# Altium project USB3.2_Hub_4Port.PrjPcb (part 1 of 2)
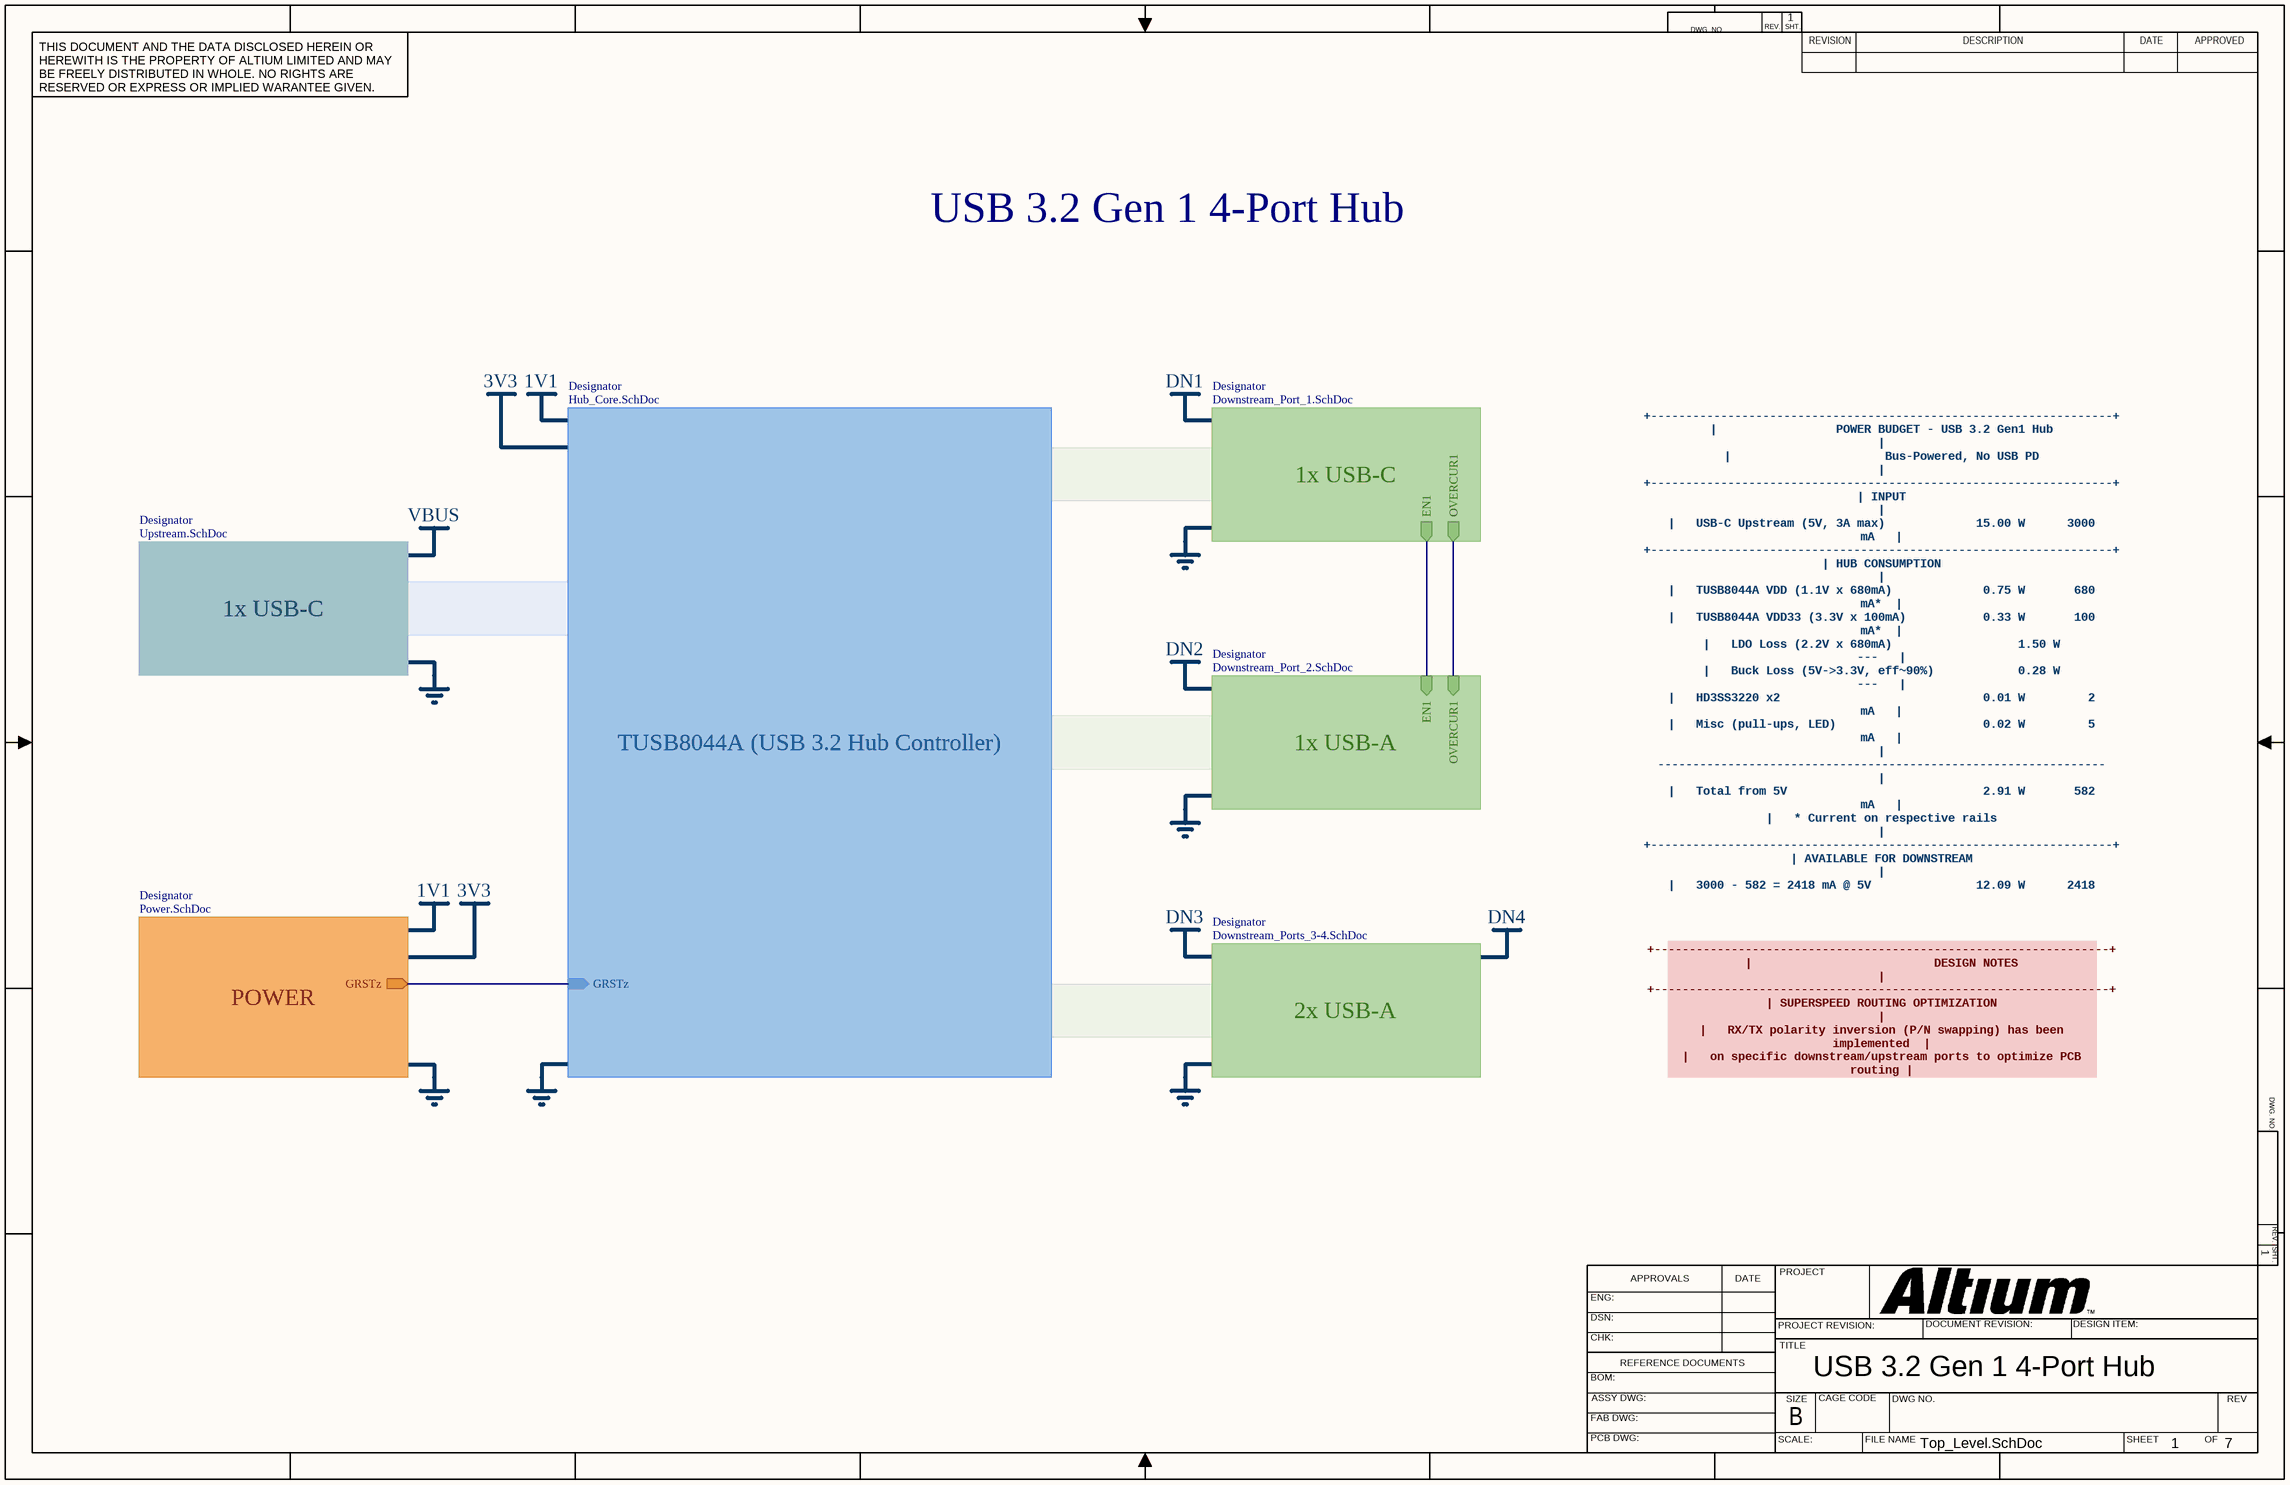
[diagram p0: Top_Level.SchDoc]
Author: Alberto Marrone; ProjectName: USB3.2_Hub_4Port; Revision: v1.0; Title: USB 3.2 Gen 1 4-Port Hub
7 sheets, 182 parts. Net scope: hierarchical (ports join the sheet entries above them; power ports are global).
Board file: USB3.2_Hub_4Port.PcbDoc
Sheets:
  Top_Level.SchDoc
    Designator = Upstream.SchDoc
    Designator = Power.SchDoc
    Designator = Hub_Core.SchDoc
    Designator = Downstream_Port_1.SchDoc
    Designator = Downstream_Ports_3-4.SchDoc
    Designator = Downstream_Port_2.SchDoc

## Sheet Top_Level.SchDoc: USB 3.2 Gen 1 4-Port Hub
size 431 x 279 mm; Author: Alberto Marrone; DrawnBy: Alberto Marrone; Engineer: Alberto Marrone; Revision: v1.0; SheetNumber: 1; SheetTotal: 7

### Sub-sheets
Designator = Upstream.SchDoc: no entries
Designator = Power.SchDoc: GRSTz (out)
Designator = Hub_Core.SchDoc: GRSTz (in)
Designator = Downstream_Port_1.SchDoc: EN1 (out), OVERCUR1 (out)
Designator = Downstream_Ports_3-4.SchDoc: no entries
Designator = Downstream_Port_2.SchDoc: OVERCUR1 (in), EN1 (in)

### Nets
EN1: sheet Designator/EN1, sheet Designator/EN1
GRSTz: sheet Designator/GRSTz, sheet Designator/GRSTz
OVERCUR1: sheet Designator/OVERCUR1, sheet Designator/OVERCUR1

### Notes on the sheet
- USB 3.2 Gen 1 4-Port Hub
- 3V3
- 1V1
- DN1
- 1x USB-C
- VBUS
- DN2
- TUSB8044A (USB 3.2 Hub Controller)
- 1x USB-A
- +------------------------------------------------------------------+
  |                 POWER BUDGET - USB 3.2 Gen1 Hub                  |
  |                      Bus-Powered, No USB PD                      |
  +------------------------------------------------------------------+
  | INPUT                                                            |
  |   USB-C Upstream (5V, 3A max)             15.00 W      3000 mA   |
  +------------------------------------------------------------------+
  | HUB CONSUMPTION                                                  |
  |   TUSB8044A VDD (1.1V x 680mA)             0.75 W       680 mA*  |
  |   TUSB8044A VDD33 (3.3V x 100mA)           0.33 W       100 mA*  |
  |   LDO Loss (2.2V x 680mA)                  1.50 W          ---   |
  |   Buck Loss (5V->3.3V, eff~90%)            0.28 W          ---   |
  |   HD3SS3220 x2                             0.01 W         2 mA   |
  |   Misc (pull-ups, LED)                     0.02 W         5 mA   |
  | ---------------------------------------------------------------- |
  |   Total from 5V                            2.91 W       582 mA   |
  |   * Current on respective rails                                  |
  +------------------------------------------------------------------+
  | AVAILABLE FOR DOWNSTREAM                                         |
  |   3000 - 582 = 2418 mA @ 5V               12.09 W      2418 mA   |
  +------------------------------------------------------------------+
  | PORT CURRENT LIMITS (Per Channel)                                |
  |   P1 USB-C (TPS2561#1)   R_ILIM=37.4k                1.5 A max   |
  |   P2 USB-A (TPS2561#1)   R_ILIM=37.4k                1.5 A max   |
  |   P3 USB-A (TPS2561#2)   R_ILIM=56.0k                1.0 A max   |
  |   P4 USB-A (TPS2561#2)   R_ILIM=56.0k                1.0 A max   |
  | ---------------------------------------------------------------- |
  |   Worst case all ports:                  5.0 A  [EXCEEDS BUDGET] |
  |   Typical 2 ports:                      ~1.0 A  [WITHIN BUDGET]  |
  +------------------------------------------------------------------+
  | NOTES                                                            |
  |   - Worst case exceeds 3A upstream. PC Host overcurrent          |
  |     protection will limit total draw.                            |
  |   - BC 1.2 CDP: 1.5A/port while data active.                     |
  |   - BC 1.2 DCP: 1.5A/port, upstream absent.                      |
  +------------------------------------------------------------------+
- DN3
- DN4
- POWER
- 2x USB-A
- +-----------------------------------------------------------------+
  |                          DESIGN NOTES                           |
  +-----------------------------------------------------------------+
  | SUPERSPEED ROUTING OPTIMIZATION                                 |
  |   RX/TX polarity inversion (P/N swapping) has been implemented  |
  |   on specific downstream/upstream ports to optimize PCB routing |
  |   and preserve Signal Integrity. This is fully compliant with   |
  |   the USB 3.2 Gen 1 specification, which mandates automatic     |
  |   polarity inversion detection at the receiver.                 |
  +-----------------------------------------------------------------+
- DWG. NO.
- REV.
- SHT.
- THIS DOCUMENT AND THE DATA DISCLOSED HEREIN OR HEREWITH IS THE PROPERTY OF ALTIUM LIMITED AND MAY BE FREELY DISTRIBUTED IN WHOLE. NO RIGHTS ARE RESERVED OR EXPRESS OR IMPLIED WARANTEE GIVEN.
- REVISION
- DESCRIPTION
- DATE
- APPROVED
- ENG:
- APPROVALS
- PROJECT
- DSN:
- CHK:
- REFERENCE DOCUMENTS
- PROJECT REVISION:
- TITLE
- DOCUMENT REVISION:
- DESIGN ITEM:
- BOM:
- FAB DWG:
- PCB DWG:
- ASSY DWG:
- SCALE:
- SIZE
- B
- CAGE CODE
- FILE NAME
- DWG NO.
- SHEET
- OF
- REV

## Sheet Upstream.SchDoc: USB 3.2 Gen 1 4-Port Hub
size 431 x 279 mm; Author: Alberto Marrone; DrawnBy: Alberto Marrone; Engineer: Alberto Marrone; Revision: v1.0; SheetNumber: 3; SheetTotal: 7
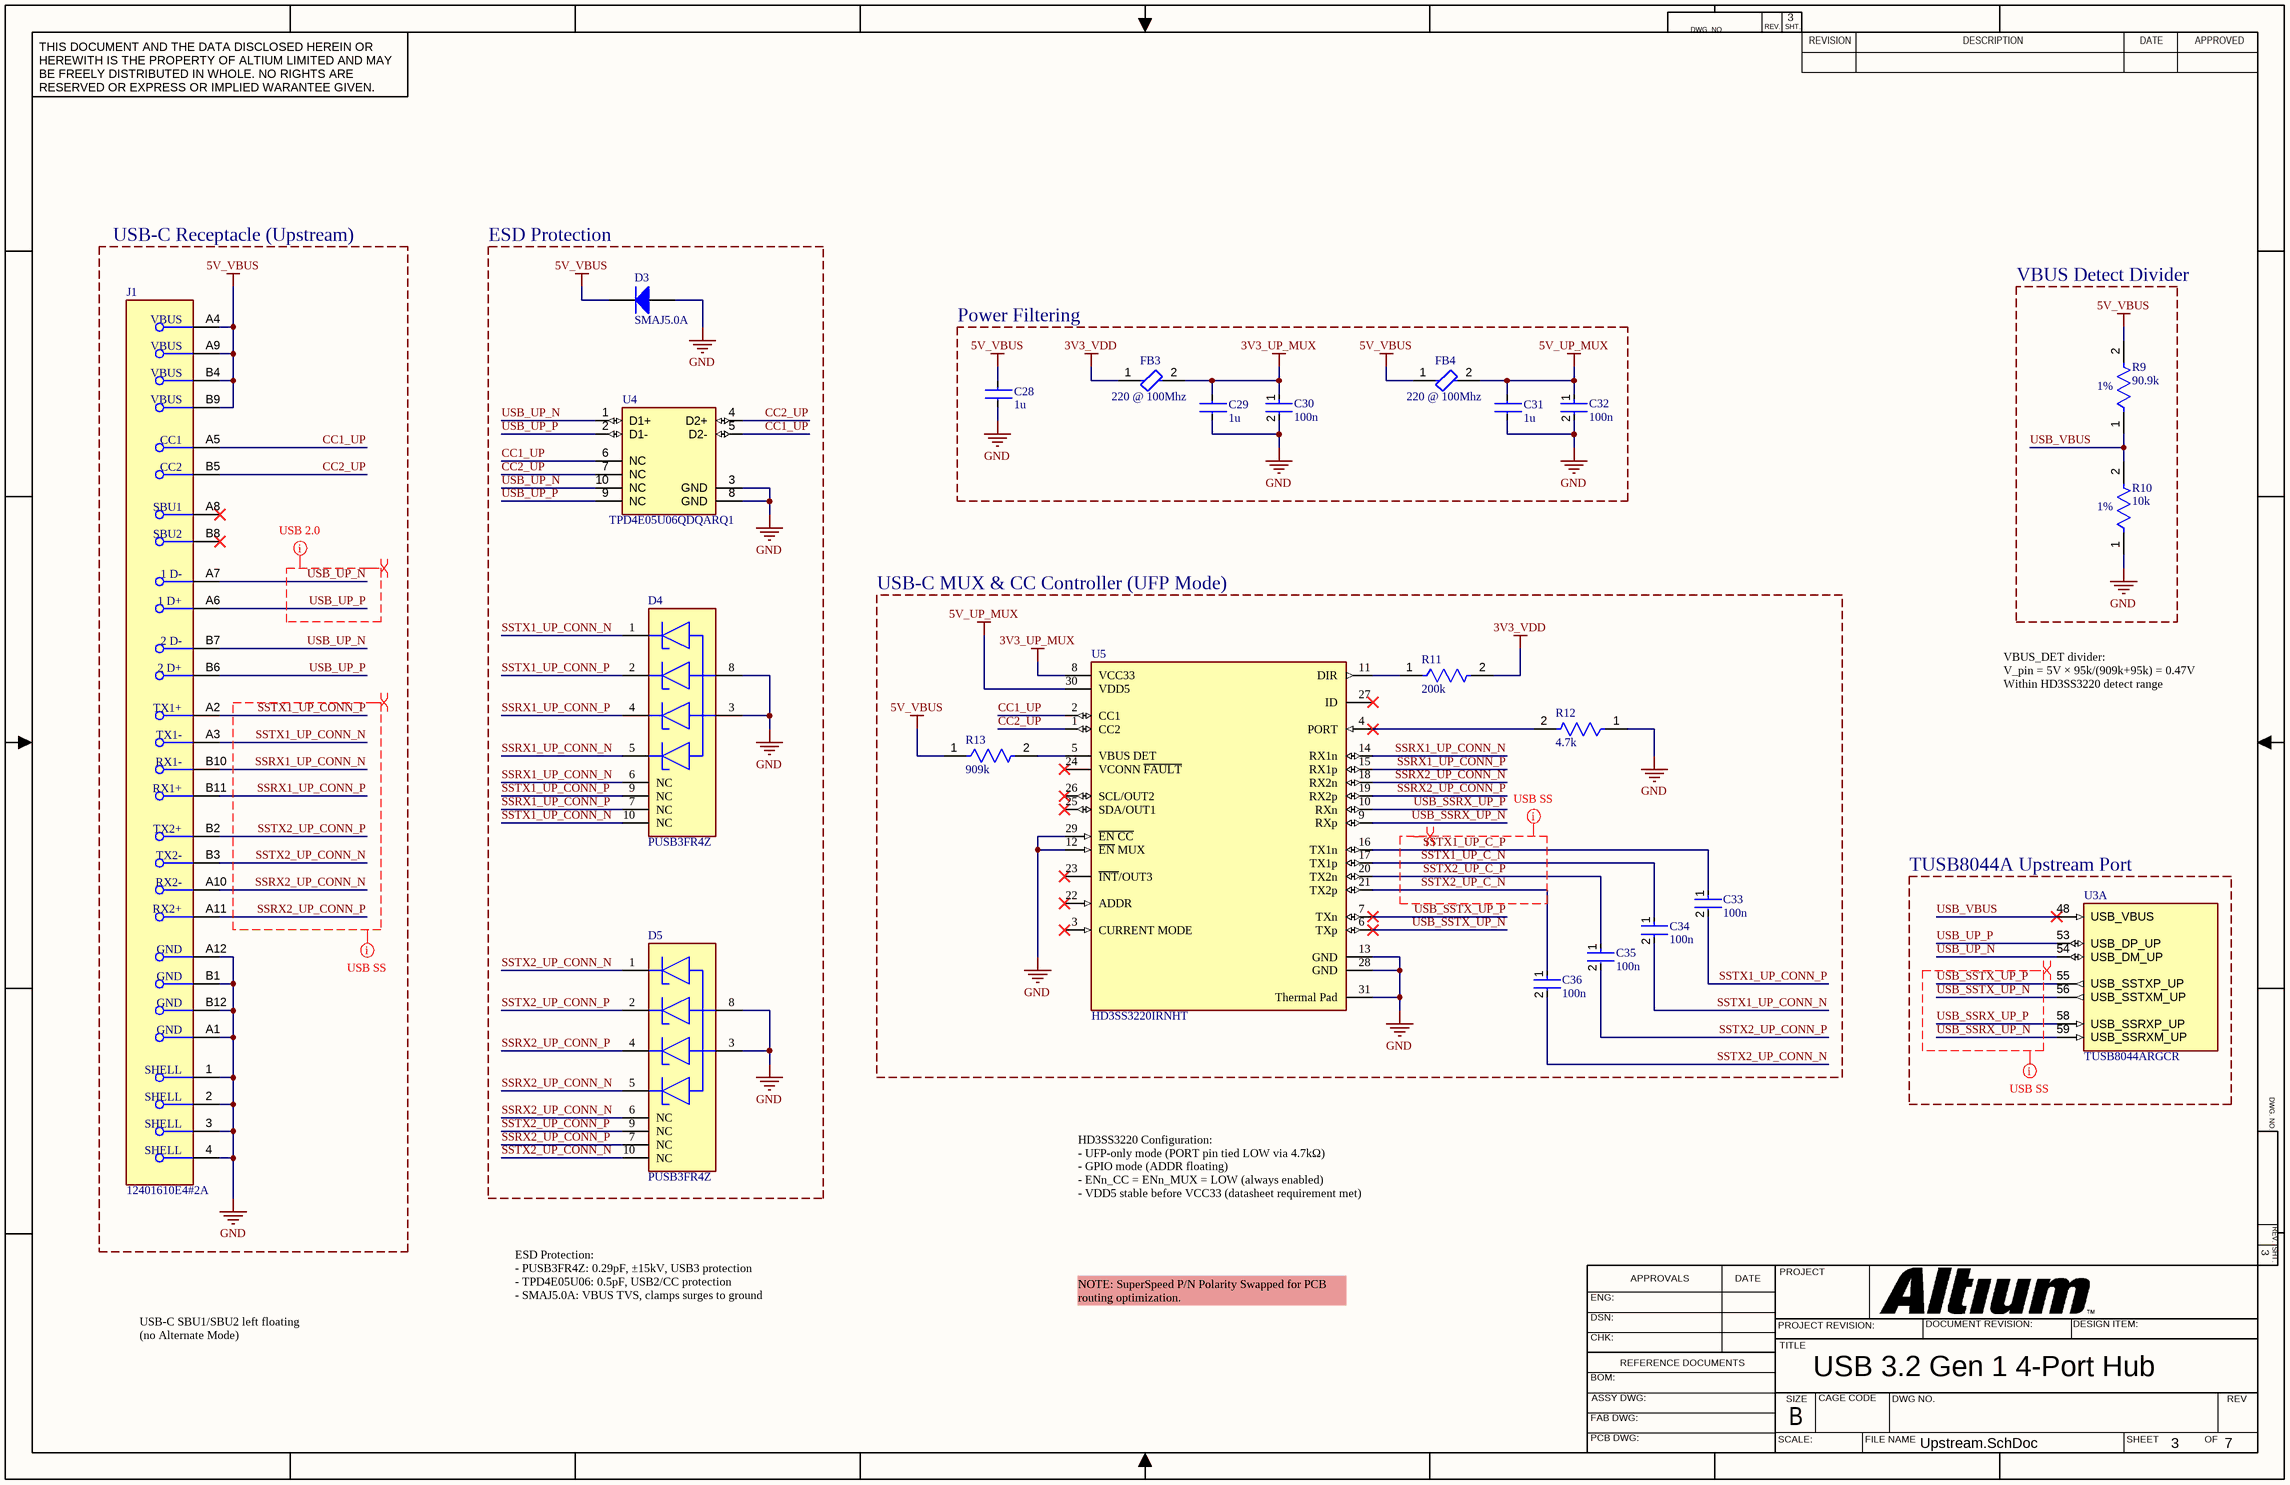
[diagram p1: Upstream.SchDoc]

### Parts
C28  1u  [CAPC1608X90N]
C29  1u  [CAPC1608X90N]
C30  100n  [FP-GRT155-0_05-IPC_C]
C31  1u  [CAPC1608X90N]
C32  100n  [FP-GRT155-0_05-IPC_C]
C33  100n  [FP-GRT155-0_05-IPC_C]
C34  100n  [FP-GRT155-0_05-IPC_C]
C35  100n  [FP-GRT155-0_05-IPC_C]
C36  100n  [FP-GRT155-0_05-IPC_C]
D3  SMAJ5.0A  [BOUR-SMA-2_V]
D4  PUSB3FR4Z  [FP-SOT1176-1-MFG]
D5  PUSB3FR4Z  [FP-SOT1176-1-MFG]
FB3  220 @ 100Mhz  [FP-BLM21-0_2-t0_85-e0_5-IPC_B]
FB4  220 @ 100Mhz  [FP-BLM21-0_2-t0_85-e0_5-IPC_B]
J1  12401610E4#2A  [FP-12401610E4#2A-MFG]
R9  90.9k  [FP-AC0402-MFG]
R10  10k  [FP-AC0402-MFG]
R11  200k  [FP-AC0402-MFG]
R12  4.7k  [FP-AC0402-MFG]
R13  909k  [FP-AC0402-IPC_A]
U3  TUSB8044ARGCR  [QFN50P900X900X100-65N-D]  (part A of 6)
U4  TPD4E05U06QDQARQ1  [FP-DQA0010A-MFG]
U5  HD3SS3220IRNHT  [FP-RNH0030A-MFG]

### Blocks framed on the sheet
USB-C Receptacle (Upstream): J1
ESD Protection: D3-D5 U4
Power Filtering: C28-C32 FB3 FB4
VBUS Detect Divider: R9 R10
USB-C MUX & CC Controller (UFP Mode): C33-C36 R11-R13 U5
TUSB8044A Upstream Port: U3

### Nets
3V3_UP_MUX: C29.2 C30.1 FB3.2 U5.8(VCC33)
3V3_VDD: FB3.1 R11.2
5V_UP_MUX: C31.2 C32.1 FB4.2 U5.30(VDD5)
5V_VBUS: C28.2 D3.2(K) FB4.1 J1.A4(VBUS) J1.A9(VBUS) J1.B4(VBUS) J1.B9(VBUS) R9.2 R13.1
GND: C28.1 C29.1 C30.2 C31.1 C32.2 D3.1(A) D4.3(GND) D4.8(GND) D5.3(GND) D5.8(GND) J1.1(SHELL) J1.2(SHELL) J1.3(SHELL) J1.4(SHELL) J1.A1(GND) J1.A12(GND) J1.B1(GND) J1.B12(GND) R10.1 R12.1 U4.3(GND) U4.8(GND) U5.12(~{EN}_MUX) U5.13(GND) U5.28(GND) U5.29(~{EN_CC}) U5.31(Thermal_Pad)
CC1_UP: J1.A5(CC1) U4.5(D2-) U4.6(NC) U5.2(CC1)
CC2_UP: J1.B5(CC2) U4.4(D2+) U4.7(NC) U5.1(CC2)
SSRX1_UP_CONN_N: D4.5(CH4) D4.6(NC) J1.B10(RX1-) U5.14(RX1n)
SSRX1_UP_CONN_P: D4.4(CH3) D4.7(NC) J1.B11(RX1+) U5.15(RX1p)
SSRX2_UP_CONN_N: D5.5(CH4) D5.6(NC) J1.A10(RX2-) U5.18(RX2n)
SSRX2_UP_CONN_P: D5.4(CH3) D5.7(NC) J1.A11(RX2+) U5.19(RX2p)
SSTX1_UP_C_N: C34.1 U5.17(TX1p)
SSTX1_UP_C_P: C33.1 U5.16(TX1n)
SSTX1_UP_CONN_N: C34.2 D4.1(CH1) D4.10(NC) J1.A3(TX1-)
SSTX1_UP_CONN_P: C33.2 D4.2(CH2) D4.9(NC) J1.A2(TX1+)
SSTX2_UP_C_N: C36.1 U5.21(TX2p)
SSTX2_UP_C_P: C35.1 U5.20(TX2n)
SSTX2_UP_CONN_N: C36.2 D5.1(CH1) D5.10(NC) J1.B3(TX2-)
SSTX2_UP_CONN_P: C35.2 D5.2(CH2) D5.9(NC) J1.B2(TX2+)
USB_SSRX_UP_N: U3.59(USB_SSRXM_UP) U5.9(RXp)
USB_SSRX_UP_P: U3.58(USB_SSRXP_UP) U5.10(RXn)
USB_SSTX_UP_N: U3.56(USB_SSTXM_UP) U5.6(TXp)
USB_SSTX_UP_P: U3.55(USB_SSTXP_UP) U5.7(TXn)
USB_UP_N: J1.A7(1_D-) J1.B7(2_D-) U3.54(USB_DM_UP) U4.1(D1+) U4.10(NC)
USB_UP_P: J1.A6(1_D+) J1.B6(2_D+) U3.53(USB_DP_UP) U4.2(D1-) U4.9(NC)
USB_VBUS: R9.1 R10.2 U3.48(USB_VBUS)
NetR11_1: R11.1 U5.11(DIR)
NetR12_2: R12.2 U5.4(PORT)
NetR13_2: R13.2 U5.5(VBUS_DET)

Not connected (* = marked no-connect by the designer): J1 A8(SBU1)* B8(SBU2)*; U5 3(CURRENT_MODE)* 22(ADDR)* 23(~{INT}/OUT3)* 24(VCONN_~{FAULT})* 25(SDA/OUT1)* 26(SCL/OUT2)* 27(ID)*

### Layout directives
differential pair: SSRX1_UP_CONN_N, SSRX1_UP_CONN_P, SSRX2_UP_CONN_N, SSRX2_UP_CONN_P, SSTX1_UP_C_N, SSTX1_UP_C_P, SSTX1_UP_CONN_N, SSTX1_UP_CONN_P, SSTX2_UP_C_N, SSTX2_UP_C_P, SSTX2_UP_CONN_N, SSTX2_UP_CONN_P, USB_SSRX_UP_N, USB_SSRX_UP_P, USB_SSTX_UP_N, USB_SSTX_UP_P, USB_UP_N, USB_UP_P
net class USB_SuperSpeed: SSRX1_UP_CONN_N, SSRX1_UP_CONN_P, SSRX2_UP_CONN_N, SSRX2_UP_CONN_P, SSTX1_UP_C_N, SSTX1_UP_C_P, SSTX1_UP_CONN_N, SSTX1_UP_CONN_P, SSTX2_UP_C_N, SSTX2_UP_C_P, SSTX2_UP_CONN_N, SSTX2_UP_CONN_P, USB_SSRX_UP_N, USB_SSRX_UP_P, USB_SSTX_UP_N, USB_SSTX_UP_P
net class USB_HighSpeed: USB_UP_N, USB_UP_P

### Notes on the sheet
- (near R9) 1%
- (near R10) 1%
- VBUS_DET divider:
  V_pin = 5V × 95k/(909k+95k) = 0.47V
  Within HD3SS3220 detect range
- HD3SS3220 Configuration:
  - UFP-only mode (PORT pin tied LOW via 4.7kΩ)
  - GPIO mode (ADDR floating)
  - ENn_CC = ENn_MUX = LOW (always enabled)
  - VDD5 stable before VCC33 (datasheet requirement met)
- NOTE: SuperSpeed P/N Polarity Swapped for PCB routing optimization.
- USB-C SBU1/SBU2 left floating
  (no Alternate Mode)
- ESD Protection:
  - PUSB3FR4Z: 0.29pF, ±15kV, USB3 protection
  - TPD4E05U06: 0.5pF, USB2/CC protection
  - SMAJ5.0A: VBUS TVS, clamps surges to ground
- DWG. NO.
- REV.
- SHT.
- THIS DOCUMENT AND THE DATA DISCLOSED HEREIN OR HEREWITH IS THE PROPERTY OF ALTIUM LIMITED AND MAY BE FREELY DISTRIBUTED IN WHOLE. NO RIGHTS ARE RESERVED OR EXPRESS OR IMPLIED WARANTEE GIVEN.
- REVISION
- DESCRIPTION
- DATE
- APPROVED
- ENG:
- APPROVALS
- PROJECT
- DSN:
- CHK:
- REFERENCE DOCUMENTS
- PROJECT REVISION:
- TITLE
- DOCUMENT REVISION:
- DESIGN ITEM:
- BOM:
- FAB DWG:
- PCB DWG:
- ASSY DWG:
- SCALE:
- SIZE
- B
- CAGE CODE
- FILE NAME
- DWG NO.
- SHEET
- OF
- REV

### Library data of the parts
C28 C29 C31 = C1608X7R1H105K080AB: The superior mechanical strength and reliability due to the monolithic structure.  Low ESR, ESL and excellent frequency characteristics allow for a circuit design that closely conforms to theoretical values.  Low self-heating and high ripple resistance due to low ESR.  No polarity; Manufacturer_Name: TDK; Geometry.Height: 0.9mm; Mouser Part Number: 810-C1608X7R1H105K08; Mouser Price/Stock: https://www.mouser.co.uk/ProductDetail/TDK/C1608X7R1H105K080AB?qs=efUn273yAhdzCWVW9RXgig%3D%3D; Manufacturer_Part_Number: C1608X7R1H105K080AB; Datasheet Link: https://media.digikey.com/pdf/Data%20Sheets/TDK%20PDFs/mlcc_commercial_general_Rev2018.pdf
C30 C32-C36 = CMP-06035-030480-1: Multi-Layer Ceramic Capacitor 100nF 50V X7R ±10% 0402 Paper T/R
D3 = CMP-2000-07090-1: SMAJ Transient Voltage Suppressor Diode Series, 3.5 V, -55 to 150 degC, 2-Pin SMA, RoHS, Tape and Reel; Manufacturer: Bourns; EDA / CAD Models: DownloadfromAcceleratedDesigns; Unidirectional Channels: 1; Voltage - Breakdown (Min): 6.4V; Voltage - Reverse Standoff (Typ): 5V; Voltage - Clamping (Max) @ Ipp: 9.2V; Other Names: SMAJ5.0ABDKR; Type: Zener; Catalog Drawings: SMAJSeriesFootprintSMAJ,SMBJSeries; Featured Product: SMAJ/SMBJ/SMCJ/SMLJDiscreteTVSDiodes; Power - Peak Pulse: 400W; Current - Peak Pulse (10/1000µs): 43.5A; Power Line Protection: No; Online Catalog: SMAJSeries; Supplier Device Package: SMA(DO-214AC); Operating Temperature: -55°C~150°C(TJ); Package Description: 2-Pin Surface Mount Device, Body 4.315 x 2.605 mm; Datasheet URL: https://datasheet.ciiva.com/25624/0900766b8112213b-25624680.pdf; Manufacturer URL: http://www.bourns.com/; Datasheet Version: 08/2012; Series: SMAJ; Family: TVS-Diodes; Bidirectional Channels: -; Applications: GeneralPurpose; Package Reference: SMA-2; Standard Package: 1; Package / Case: DO-214AC,SMA; Category: CircuitProtection; RoHS Information: SMAJSeriesMaterialDeclaration; Mounting Technology: SurfaceMount; Capacitance @ Frequency: -; Packaging: Digi-Reel®; Mounting Type: SurfaceMount
D4 D5 = CMP-14432-000005-1: TVS DIODE 3.3VWM 3VC DFN2510A-10; RoHS Compliant: Yes
FB3 FB4 = CMP-0686-00610-3: Chip Ferrite Bead, 0805, 220Ω @ 100MHz, 0.045Ω, 25%, 2A; Number of Circuits: 1; Shielding: Unshielded; DC Resistance (DCR): 45mR; Impedance: 220R; Radiation Hardening: No; Material: Ferrite; Frequency: 100MHz; Width: 1.25mm; DC Current: 2A; Max DC Current: 2A; Number of Lines: 1; Package Quantity: 1; Case Code (Metric): 2012; Current Rating: 2A; Case/Package: 0805; Current: 2A; Military Standard: Not; Core Material: Ferrite; Depth: 1.25mm; Contact Plating: Tin; DC Resistance-Max: 45mR; Max Operating Temperature: 125°C; Length: 2mm; Max Current Rating: 2A; REACH SVHC: No SVHC; Termination: SMD/SMT; Min Operating Temperature: -55°C; Series: BLM21P; Test Frequency: 100MHz; Tolerance: 25%; Number of Pins: 2; RoHS Compliant: Yes; Height: 0.85mm; Packaging: Tape and Reel; Lead Free: Lead Free; Case Code (Imperial): 0805
J1 = CMP-02355-000003-1: CONN RCP USB3.1 TYPEC 24P SMD RA; Connector Type: USB; Number of Contacts: 24; Gender: Receptacle; Packaging: Cut Tape; Mount: Surface Mount; Number of Pins: 24
R9 = CMP-03412-009342-2: RES 90.9kΩ ±1% 0.063W 0402; Voltage Rating: 50V; Resistance: 90.9kR; Temperature Coefficient: 100ppm/°C; Max Power Dissipation: 63mW; Power Rating: 62.5mW; Resistor Type: Thick Film; Length: 0.039inch; RoHS Compliant: Yes; Features: Moisture Resistant; Height: 0.015inch; Case Code (Imperial): 0402; Tolerance: 1%; Min Operating Temperature: -55°C; Case/Package: 0402; Width: 0.5mm; Series: AC; Termination: SMD/SMT; Number of Terminations: 2; Max Operating Temperature: 155°C; Case Code (Metric): 1005; Packaging: Tape and Reel
R10 = CMP-2002-01790-3: RES 10kΩ ±1% 0.063W 0402; Power Rating: 62.5mW; Voltage Rating: 50V; Temperature Coefficient: 100ppm/°C; Resistance: 10kR; Max Power Dissipation: 63mW; Tolerance: 1%; Military Standard: Not; Construction: Rectangular; Termination: SMD/SMT; Max Operating Temperature: 155°C; Min Operating Temperature: -55°C; Height: 0.015inch; Lead Free: Lead Free; Width: 0.02inch; Case/Package: 0402; Resistor Type: Thick Film; Series: AC; Features: Moisture Resistant; RoHS Compliant: Yes; Number of Terminations: 2; Case Code (Metric): 1005; Length: 0.039inch; Depth: 0.5mm; Size Code: 0402; Packaging: Tape and Reel; Case Code (Imperial): 0402
R11 = CMP-03412-002362-2: RES 200kΩ ±1% 0.063W 0402; Temperature Coefficient: 100ppm/°C; Voltage Rating: 50V; Max Power Dissipation: 63mW; Power Rating: 62.5mW; Resistance: 200kR; RoHS Compliant: Yes; Series: AC; Height: 0.015inch; Termination: SMD/SMT; Case Code (Imperial): 0402; Min Operating Temperature: -55°C; Weight: 2.3E-05oz; Case Code (Metric): 1005; Case/Package: 0402; Max Operating Temperature: 155°C; Width: 0.5mm; Size Code: 0402; Features: Moisture Resistant; Number of Terminations: 2; Tolerance: 1%; Packaging: Tape and Reel; Lead Free: Lead Free; Resistor Type: Thick Film; Length: 0.039inch
R12 = CMP-03412-009386-2: RES 4.7kΩ ±1% 0.063W 0402
R13 = CMP-03412-019105-2: RES 909kΩ ±1% 0.063W 0402; Power Rating: 62.5mW; Voltage Rating: 50V; Resistance: 909kR; Temperature Coefficient: 100ppm/°C; Max Power Dissipation: 63mW; Number of Terminations: 2; Packaging: Tape and Reel; Height: 0.015inch; Max Operating Temperature: 155°C; Series: AC; Resistor Type: Thick Film; Features: Moisture Resistant; Width: 0.5mm; RoHS Compliant: Yes; Length: 0.039inch; Case/Package: 0402; Min Operating Temperature: -55°C; Tolerance: 1%; Termination: SMD/SMT; Case Code (Imperial): 0402; Case Code (Metric): 1005
U3 = TUSB8044ARGCR: Four-port USB 3.2 x1 Gen1 hub with USB billboard; Manufacturer_Name: Texas Instruments; Geometry.Height: 1mm; Mouser Part Number: 595-TUSB8044ARGCR; Mouser Price/Stock: https://www.mouser.co.uk/ProductDetail/Texas-Instruments/TUSB8044ARGCR?qs=9r4v7xj2LnlTBCFutY1Bfg%3D%3D; Manufacturer_Part_Number: TUSB8044ARGCR; Datasheet Link: http://www.ti.com/lit/gpn/TUSB8044A
U4 = CMP-04985-000004-1: TVS DIODE 5.5V 14V 10USON; Manufacturer: Texas Instruments; Direction: Unidirectional; Standoff Height: 0mm; Capacitance: 0.5pF; Number Of Channels: 4; Breakdown Voltage: 6.4V; Peak Pulse Power: 2.5W; Automotive Grade: Grade 1; Value: 0.5pF; Interface: USB,Ethernet,LVDS,Other; Peak Pulse Current: 2.5A; Operating Supply Voltage: 5.5V; Reverse Standoff Voltage: 5.5V; Package: DQA0010A; Temperature Range Low: -40°C; Temperature Range High: +125°C; Ambient Temperature Range Low: -40°C; Device Class L1: Circuit Protection; Clamping Voltage: 14V; Manufacturer Part Number: TPD4E05U06QDQARQ1; Device Class L2: ESD and Circuit Protection ICs; Octopart: https://octopart.com/tpd4e05u06qdqarq1-texas+instruments-48523459; Device Class L3: unset; Height: 0.55mm; Automotive: Yes; ComponentLink2Description: Datasheet; RoHS: TRUE; Ambient Temperature Range High: +125°C; Category: IC; Mouser Description: Automotive 4-Channel ESD Protection Solution for SuperSpeed (up to 5 Gbps) Interface 10-USON -40 to 125; Temperature: -40°C to +125°C; ComponentLink2URL: http://www.ti.com/lit/ds/symlink/tpd4e05u06-q1.pdf; Digikey Description: TVS DIODE 5.5V 14V 10USON; Lead Free: Yes
U5 = CMP-04877-000019-1: USB TYPE-C DRP PORT CONTROLLER W; Max Supply Voltage: 5.5V; Min Supply Voltage: 3V; Number of Ports: 1; Data Rate: 10Gbps; USB Standard: USB 3.1; Mount: Surface Mount; Max Operating Temperature: 70°C; Lead Free: Lead Free; RoHS Compliant: Yes; Packaging: Tape and Reel; Number of Pins: 30; Min Operating Temperature: 0°C; REACH SVHC: No SVHC

## Sheet Power.SchDoc: USB 3.2 Gen 1 4-Port Hub
size 431 x 279 mm; Author: Alberto Marrone; DrawnBy: Alberto Marrone; Engineer: Alberto Marrone; Revision: v1.0; SheetNumber: 2; SheetTotal: 7
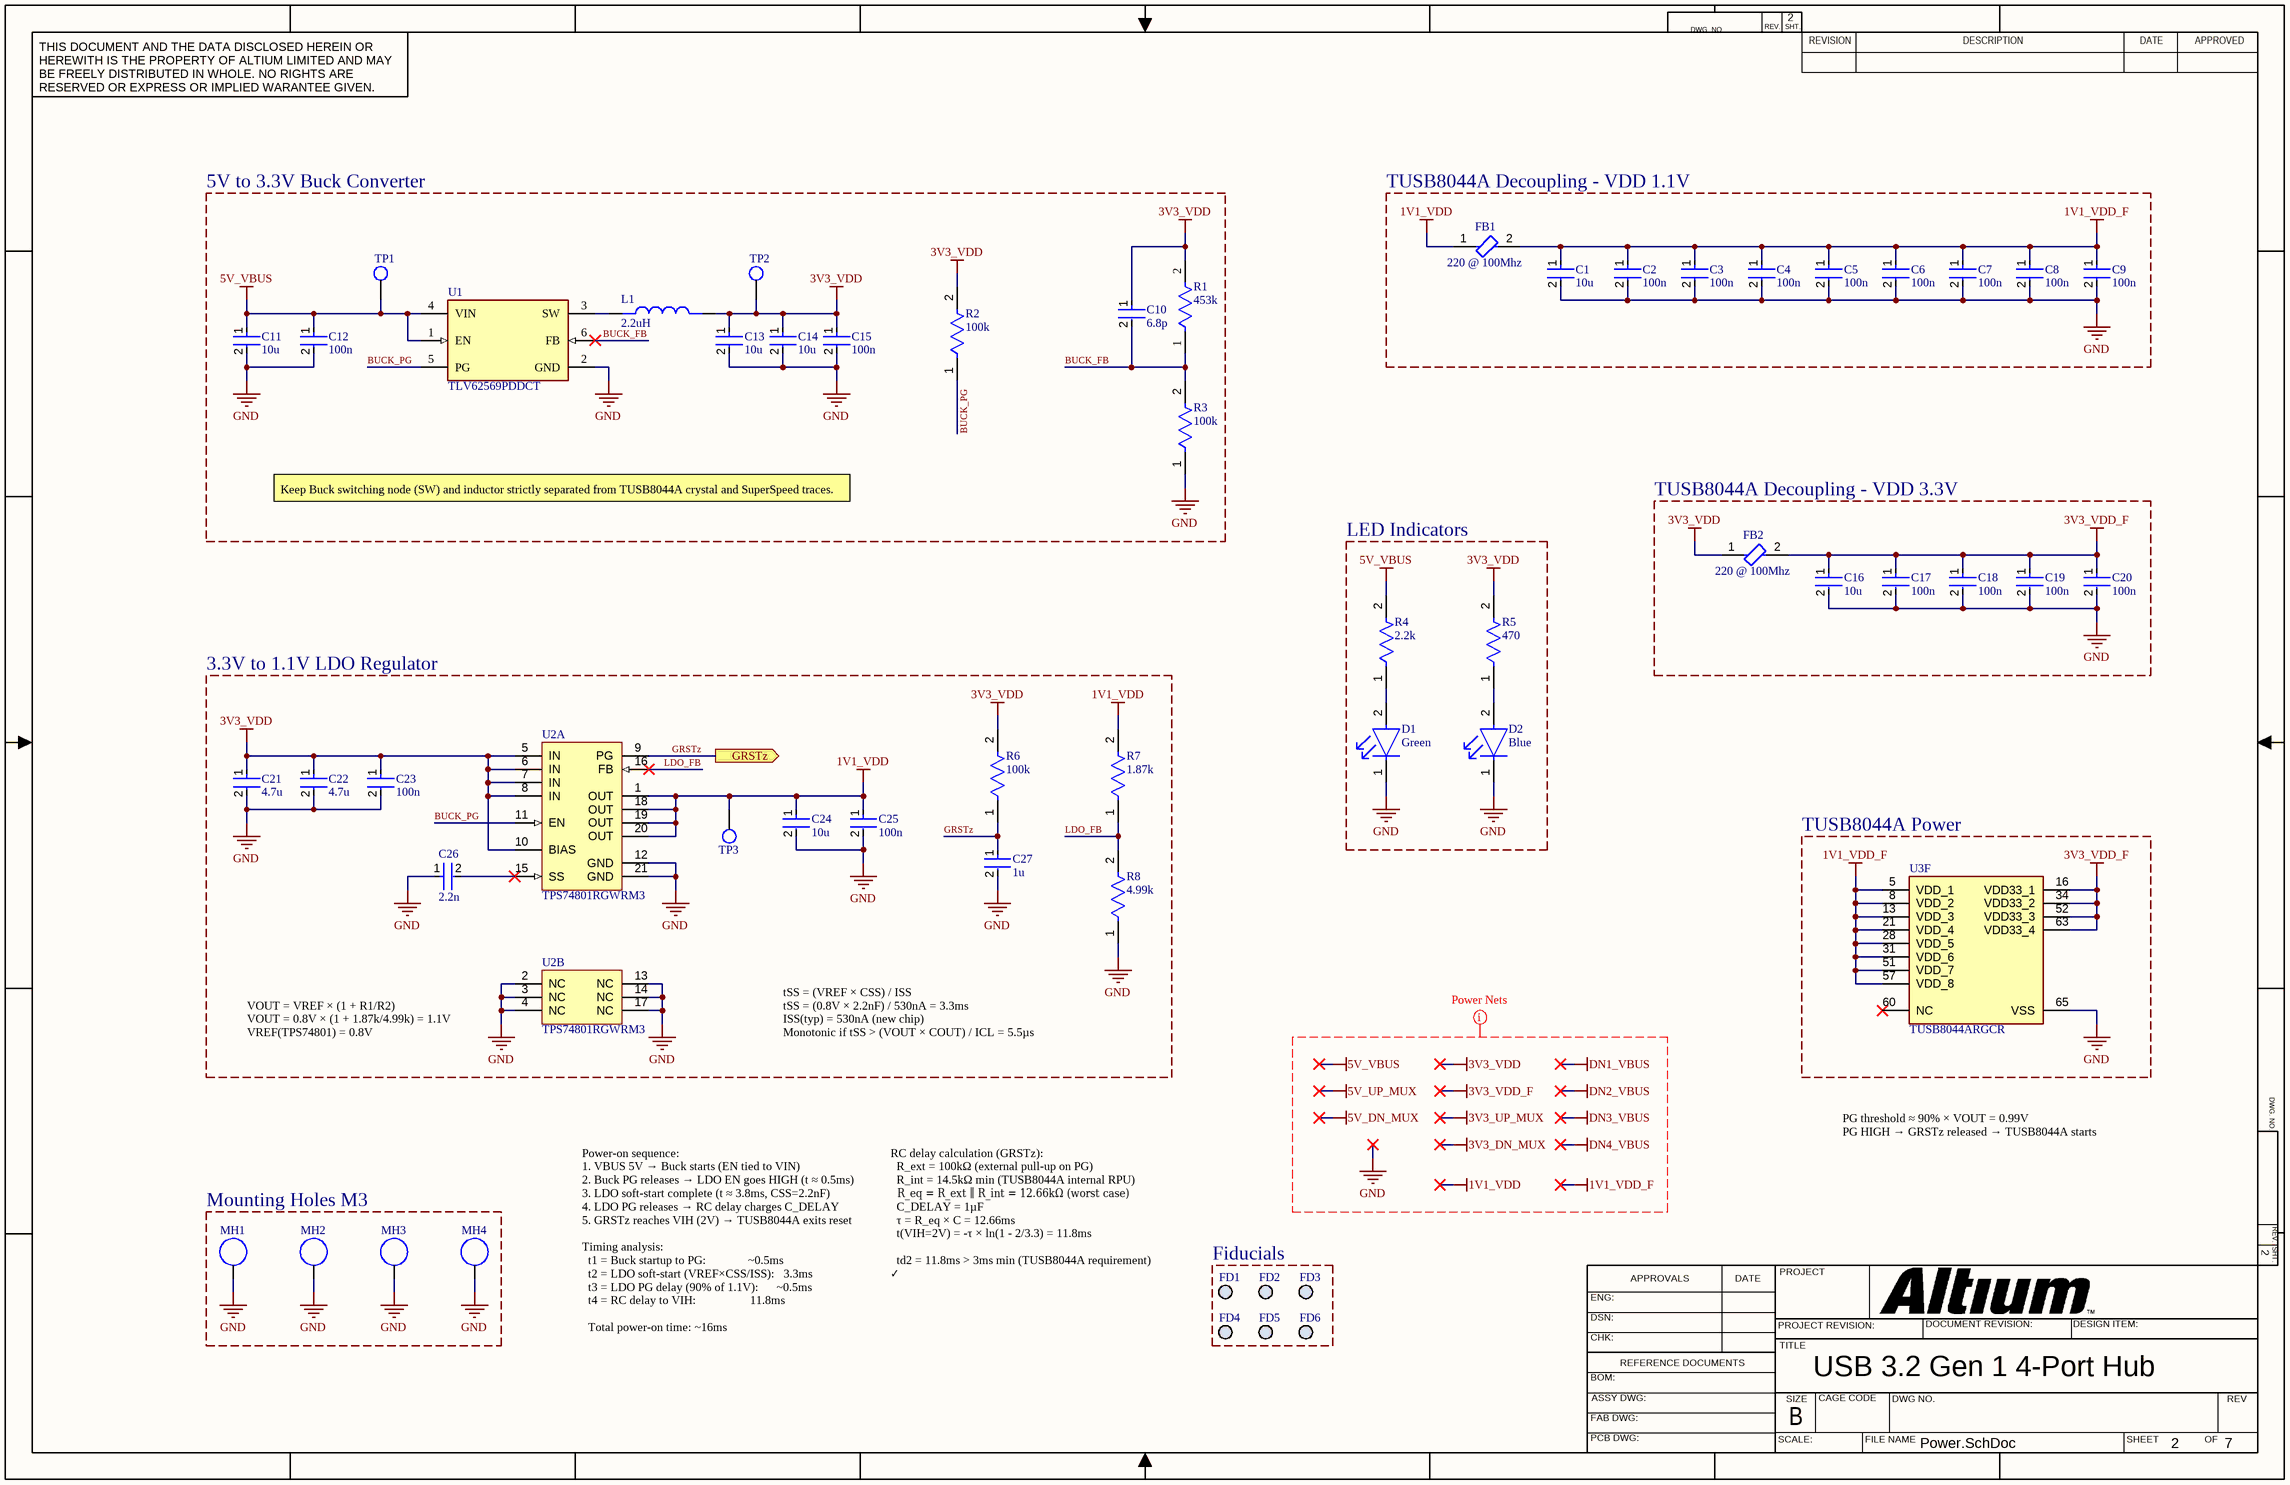
[diagram p2: Power.SchDoc]

### Parts
C1  10u  [FP-GRM21B-0_2-e0_2_0_7-IPC_B]
C2  100n  [FP-GRT155-0_05-IPC_C]
C3  100n  [FP-GRT155-0_05-IPC_C]
C4  100n  [FP-GRT155-0_05-IPC_C]
C5  100n  [FP-GRT155-0_05-IPC_C]
C6  100n  [FP-GRT155-0_05-IPC_C]
C7  100n  [FP-GRT155-0_05-IPC_C]
C8  100n  [FP-GRT155-0_05-IPC_C]
C9  100n  [FP-GRT155-0_05-IPC_C]
C10  6.8p  [FP-GCM155-0_05-IPC_B]
C11  10u  [FP-GRM21B-0_2-e0_2_0_7-IPC_B]
C12  100n  [FP-GRT155-0_05-IPC_C]
C13  10u  [FP-GRM21B-0_2-e0_2_0_7-IPC_B]
C14  10u  [FP-GRM21B-0_2-e0_2_0_7-IPC_B]
C15  100n  [FP-GRT155-0_05-IPC_C]
C16  10u  [FP-GRM21B-0_2-e0_2_0_7-IPC_B]
C17  100n  [FP-GRT155-0_05-IPC_C]
C18  100n  [FP-GRT155-0_05-IPC_C]
C19  100n  [FP-GRT155-0_05-IPC_C]
C20  100n  [FP-GRT155-0_05-IPC_C]
C21  4.7u  [FP-GRM21B-0_2-e0_2_0_7-IPC_A]
C22  4.7u  [FP-GRM21B-0_2-e0_2_0_7-IPC_A]
C23  100n  [FP-GRT155-0_05-IPC_C]
C24  10u  [FP-GRM21B-0_2-e0_2_0_7-IPC_B]
C25  100n  [FP-GRT155-0_05-IPC_C]
C26  2.2n  [FP-AC0402-0_5-MFG]
C27  1u  [FP-GRM155-0_1-IPC_C]
D1  Green  [FP-LTST-C190KGKT-MFG]
D2  Blue  [FP-LTST-C193TBKT-5A-MFG]
FB1  220 @ 100Mhz  [FP-BLM21-0_2-t0_85-e0_5-IPC_B]
FB2  220 @ 100Mhz  [FP-BLM21-0_2-t0_85-e0_5-IPC_B]
FD1  Fiducial_Marker  [Fiducial_Standard]  (value not drawn)  (no BOM)
FD2  Fiducial_Marker  [Fiducial_Standard]  (value not drawn)  (no BOM)
FD3  Fiducial_Marker  [Fiducial_Standard]  (value not drawn)  (no BOM)
FD4  Fiducial_Marker  [Fiducial_Standard]  (value not drawn)  (no BOM)
FD5  Fiducial_Marker  [Fiducial_Standard]  (value not drawn)  (no BOM)
FD6  Fiducial_Marker  [Fiducial_Standard]  (value not drawn)  (no BOM)
L1  2.2uH  [IND_ETQP3M3R3YFP]
MH1  Mounting_Hole_M3  [MH_M3_Stitched]  (value not drawn)  (no BOM)
MH2  Mounting_Hole_M3  [MH_M3_Stitched]  (value not drawn)  (no BOM)
MH3  Mounting_Hole_M3  [MH_M3_Stitched]  (value not drawn)  (no BOM)
MH4  Mounting_Hole_M3  [MH_M3_Stitched]  (value not drawn)  (no BOM)
R1  453k  [FP-ERJ2RK-MFG]
R2  100k  [FP-AC0402-MFG]
R3  100k  [FP-AC0402-MFG]
R4  2.2k  [FP-AC0402-MFG]
R5  470  [FP-AC0402-MFG]
R6  100k  [FP-AC0402-MFG]
R7  1.87k  [FP-AC0402-IPC_A]
R8  4.99k  [FP-AC0402-IPC_A]
TP1  Test_Point  [Test_Point]  (value not drawn)  (no BOM)
TP2  Test_Point  [Test_Point]  (value not drawn)  (no BOM)
TP3  Test_Point  [Test_Point]  (value not drawn)  (no BOM)
U1  TLV62569PDDCT  [FP-DDC0006A-IPC_C]
U2  TPS74801RGWRM3  [TI-RGW20-3150X3150TP_V]  (parts A,B of 2)
U3  TUSB8044ARGCR  [QFN50P900X900X100-65N-D]  (part F of 6)

### Blocks framed on the sheet
5V to 3.3V Buck Converter: C10-C15 L1 R1-R3 TP1 TP2 U1
TUSB8044A Decoupling - VDD 1.1V: C1-C9 FB1
LED Indicators: D1 D2 R4 R5
TUSB8044A Decoupling - VDD 3.3V: C16-C20 FB2
3.3V to 1.1V LDO Regulator: C21-C27 R6-R8 TP3 U2
TUSB8044A Power: U3
Mounting Holes M3: MH1-MH4
Fiducials: FD1-FD6

### Ports
GRSTz (out, see Top_Level[7C], Hub_Core[5D])

### Nets
1V1_VDD: C24.1 C25.1 FB1.1 R7.2 TP3.1 U2.1(OUT) U2.18(OUT) U2.19(OUT) U2.20(OUT)
1V1_VDD_F: C1.1 C2.1 C3.1 C4.1 C5.1 C6.1 C7.1 C8.1 C9.1 FB1.2 U3.5(VDD_1) U3.8(VDD_2) U3.13(VDD_3) U3.21(VDD_4) U3.28(VDD_5) U3.31(VDD_6) U3.51(VDD_7) U3.57(VDD_8)
3V3_VDD: C10.1 C13.1 C14.1 C15.1 C21.1 C22.1 C23.1 FB2.1 L1.2 R1.2 R2.2 R5.2 R6.2 TP2.1 U2.5(IN) U2.6(IN) U2.7(IN) U2.8(IN) U2.10(BIAS)
3V3_VDD_F: C16.1 C17.1 C18.1 C19.1 C20.1 FB2.2 U3.16(VDD33_1) U3.34(VDD33_2) U3.52(VDD33_3) U3.63(VDD33_4)
5V_VBUS: C11.1 C12.1 R4.2 TP1.1 U1.1(EN) U1.4(VIN)
GND: C1.2 C2.2 C3.2 C4.2 C5.2 C6.2 C7.2 C8.2 C9.2 C11.2 C12.2 C13.2 C14.2 C15.2 C16.2 C17.2 C18.2 C19.2 C20.2 C21.2 C22.2 C23.2 C24.2 C25.2 C26.1 C27.2 D1.1(C) D2.1(C) MH1.1 MH2.1 MH3.1 MH4.1 R3.1 R8.1 U1.2(GND) U2.2(NC) U2.3(NC) U2.4(NC) U2.12(GND) U2.13(NC) U2.14(NC) U2.17(NC) U2.21(GND) U3.65(VSS)
BUCK_FB: C10.2 R1.1 R3.2 U1.6(FB)
BUCK_PG: R2.1 U1.5(PG) U2.11(EN)
GRSTz: C27.1 R6.1 U2.9(PG) ; port GRSTz
LDO_FB: R7.1 R8.2 U2.16(FB)
NetC26_2: C26.2 U2.15(SS)
NetD1_2: D1.2(A) R4.1
NetD2_2: D2.2(A) R5.1
NetL1_1: L1.1 U1.3(SW)

Not connected (* = marked no-connect by the designer): U3 60(NC)*

### Layout directives
net class Power_Nets: 1V1_VDD, 1V1_VDD_F, 3V3_DN_MUX, 3V3_UP_MUX, 3V3_VDD, 3V3_VDD_F, 5V_DN_MUX, 5V_UP_MUX, 5V_VBUS, DN1_VBUS, DN2_VBUS, DN3_VBUS, DN4_VBUS, GND

### Notes on the sheet
- Keep Buck switching node (SW) and inductor strictly separated from TUSB8044A crystal and SuperSpeed traces.
- VOUT = VREF × (1 + R1/R2)
  VOUT = 0.8V × (1 + 1.87k/4.99k) = 1.1V
  VREF(TPS74801) = 0.8V
- tSS = (VREF × CSS) / ISS
  tSS = (0.8V × 2.2nF) / 530nA = 3.3ms
  ISS(typ) = 530nA (new chip)
  Monotonic if tSS > (VOUT × COUT) / ICL = 5.5µs
- PG threshold ≈ 90% × VOUT = 0.99V
  PG HIGH → GRSTz released → TUSB8044A starts
- RC delay calculation (GRSTz):
  R_ext = 100kΩ (external pull-up on PG)
  R_int = 14.5kΩ min (TUSB8044A internal RPU)
  R_eq = R_ext ∥ R_int = 12.66kΩ (worst case)
  C_DELAY = 1µF
  τ = R_eq × C = 12.66ms
  t(VIH=2V) = -τ × ln(1 - 2/3.3) = 11.8ms
  td2 = 11.8ms > 3ms min (TUSB8044A requirement) ✓
- Power-on sequence:
  1. VBUS 5V → Buck starts (EN tied to VIN)
  2. Buck PG releases → LDO EN goes HIGH (t ≈ 0.5ms)
  3. LDO soft-start complete (t ≈ 3.8ms, CSS=2.2nF)
  4. LDO PG releases → RC delay charges C_DELAY
  5. GRSTz reaches VIH (2V) → TUSB8044A exits reset
  Timing analysis:
  t1 = Buck startup to PG:              ~0.5ms
  t2 = LDO soft-start (VREF×CSS/ISS):   3.3ms
  t3 = LDO PG delay (90% of 1.1V):      ~0.5ms
  t4 = RC delay to VIH:                  11.8ms
  Total power-on time: ~16ms
- DWG. NO.
- REV.
- SHT.
- THIS DOCUMENT AND THE DATA DISCLOSED HEREIN OR HEREWITH IS THE PROPERTY OF ALTIUM LIMITED AND MAY BE FREELY DISTRIBUTED IN WHOLE. NO RIGHTS ARE RESERVED OR EXPRESS OR IMPLIED WARANTEE GIVEN.
- REVISION
- DESCRIPTION
- DATE
- APPROVED
- ENG:
- APPROVALS
- PROJECT
- DSN:
- CHK:
- REFERENCE DOCUMENTS
- PROJECT REVISION:
- TITLE
- DOCUMENT REVISION:
- DESIGN ITEM:
- BOM:
- FAB DWG:
- PCB DWG:
- ASSY DWG:
- SCALE:
- SIZE
- B
- CAGE CODE
- FILE NAME
- DWG NO.
- SHEET
- OF
- REV

### Library data of the parts
C1 C11 C13 C14 C16 C24 = CMP-06035-047417-1: Chip Multilayer Ceramic Capacitors for General Purpose, 0805, 10uF, X7R, 15%, 10%, 25V
C2-C9 C12 C15 C17-C20 C23 C25 = CMP-06035-030480-1: as C30 on sheet Upstream
C10 = CMP-06035-021449-1: Ceramic Capacitor for Automotive 6.8pF ±0.1pF 50VDC C0G 0402 Paper T/R
C21 C22 = CMP-06035-048385-1: Chip Multilayer Ceramic Capacitors for General Purpose, 0805, 4.7uF, X7R, 15%, 10%, 35V
C26 = CMP-03422-000843-1: CAP CER 2200PF 50V X7R 0402; Manufacturer: Yageo; Manufacturer Part Number: AC0402KRX7R9BB222; Value: 2.2 nF; Material: Ceramic; Temperature Coefficient: ±15%; Automotive Grade: Grade 1; Tolerance: 0.1; Temperature: -55°C to +125°C; Automotive: Yes; Device Class L1: Passive Components; Device Class L2: Capacitors; Package: AC0402-0.5; RoHS: TRUE; Temperature Range Low: -55°C; ComponentLink2Description: Datasheet; Category: Cap; Mouser Description: Cap Ceramic 0.0022uF 50V X7R 10% Pad SMD 0402 125C Automotive T/R; Lead Free: Yes; Digikey Description: CAP CER 2200PF 50V X7R 0402; Capacitance: 2.2 nF; Temperature Range High: +125°C; Footprint Url: http://www.yageo.com/exep/pages/download/literatures/UPY-C_GEN_24.pdf; Height: 0.55mm; Temperature Characteristic: X7R; ComponentLink2URL: http://www.yageo.com/documents/recent/UPY-AC_NP0X7R_16V-to-630V_12.pdf; Device Class L3: Ceramic Capacitors; Octopart: https://octopart.com/ac0402krx7r9bb222-yageo-78873070; Ipc Land Pattern Name: CAPC10050X50; Voltage Rating: 50 V
C27 = CMP-06035-028020-1: Chip Multilayer Ceramic Capacitors for General Purpose, 0402, 1.0uF, X7R, 15%, 10%, 10V
D1 = CMP-2000-05197-2: LED GREEN CLEAR CHIP SMD LTST-C193TGKT-5A; Test Current: 20mA; Power Rating: 75mW; Forward Voltage: 2V; Wavelength: 574nm; Number of LEDs: 1; Reverse Voltage: 5V; Dominant Wavelength: 571nm; Lens Style: Diffused; Luminous Intensity: 35mcd; Forward Current: 30mA; Viewing Angle: 130°; Lens Color: Colorless; Width: 0.8mm; Case Code (Imperial): 0603; Case Code (Metric): 1608; Number of Pins: 2; Radiation Hardening: No; Package Quantity: 1; Lead Free: Lead Free; Lens Transparency: Clear; Depth: 0.8mm; Power Dissipation: 75mW; Mount: Surface Mount; Max Operating Temperature: 85°C; Case/Package: 0603; Height: 0.8mm; Illumination Color: Green; Color: Green; Length: 1.6mm; Packaging: Tape and Reel; Number of Elements: 1; Min Operating Temperature: -55°C; Manufacturer Part Number: LTST-C193TGKT-5A
D2 = CMP-2000-06624-2: LED BLUE CLEAR CHIP SMD LTST-C193TBKT-5A; Number of Elements: 1; Forward Voltage: 2.8V; Forward Current: 20mA; Test Current: 5mA; Lens Color: Colorless; Dominant Wavelength: 475nm; Reverse Voltage: 5V; Viewing Angle: 130°; Lens Style: Diffused; Luminous Intensity: 15mcd; Power Dissipation: 76mW; Max Operating Temperature: 80°C; Length: 1.6mm; Number of LEDs: 1; Case/Package: 0603; Case Code (Metric): 1608; Number of Pins: 2; Radiation Hardening: No; Min Operating Temperature: -20°C; Width: 0.8mm; Packaging: Tape and Reel; Package Quantity: 1; Lead Free: Lead Free; Lens Transparency: Clear; Illumination Color: Blue; Color: Blue; RoHS Compliant: Yes; Mount: Surface Mount; Depth: 0.8mm; Case Code (Imperial): 0603; Height: 0.35mm
FB1 FB2 = CMP-0686-00610-3: as FB3 on sheet Upstream; Radiation Hardening: No; Material: Ferrite; Frequency: 100MHz; Width: 1.25mm; DC Current: 2A; Max DC Current: 2A; Number of Lines: 1; Package Quantity: 1; Case Code (Metric): 2012; Current Rating: 2A; Case/Package: 0805; Current: 2A; Military Standard: Not; Core Material: Ferrite; Depth: 1.25mm; Contact Plating: Tin; DC Resistance-Max: 45mR; Max Operating Temperature: 125°C; Length: 2mm; Max Current Rating: 2A; REACH SVHC: No SVHC; Termination: SMD/SMT; Min Operating Temperature: -55°C; Series: BLM21P; Test Frequency: 100MHz; Tolerance: 25%; Number of Pins: 2; RoHS Compliant: Yes; Height: 0.85mm; Packaging: Tape and Reel; Lead Free: Lead Free; Case Code (Imperial): 0805
L1 = ETQP3M3R3YFP: ETQPSeries SMD Wire Wound Choke w/ Metal Core,3.3 uH +/-20% Wire-Wound 8.6A Idc | Panasonic Electronic Components ETQP3M3R3YFP; SnapEDA_Link: https://www.snapeda.com/parts/ETQP3M3R3YFP/Panasonic/view-part/?ref=snap; Package: Package; Value: *; MF: Panasonic; MP: ETQP3M3R3YFP; Check_prices: https://www.snapeda.com/parts/ETQP3M3R3YFP/Panasonic/view-part/?ref=eda
R1 = CMP-2002-00948-2: NexarPartId: 55421189; Power Rating: 100mW; Resistance: 453kΩ; Temperature Coefficient: 100ppm/°C; Tolerance: 1%; Voltage Rating (DC): 50V; Case Code (Metric): 1005; RoHS: Compliant; Length: 1mm; Case Code (Imperial): 0402; Depth: 500µm; Lead Free: Lead Free; Mount: Surface Mount; Termination: SMD/SMT; Schedule B: 8533210045, 8533210045; Max Operating Temperature: 155°C; Max Power Dissipation: 100mW; Width: 508µm; Case/Package: 0402; Military Standard: Not; Number of Terminations: 2; Contact Plating: Tin; Lifecycle Status: Production; Composition: Thick Film; Min Operating Temperature: -55°C; Height: 350µm; Packaging: Cut Tape; Voltage Rating: 50V; REACH SVHC: Yes
R2-R6 = CMP-03412-039042-1: RES 100kΩ ±1% 0.125W 0402
R7 = CMP-03412-017080-2: RES 1.87kΩ ±1% 0.063W 0402; Temperature Coefficient: 100ppm/°C; Resistance: 1.87kR; Max Power Dissipation: 63mW; Features: Moisture Resistant; Width: 0.02inch; Packaging: Tape and Reel; Series: AC; Height: 0.015inch; Min Operating Temperature: -55°C; Number of Terminations: 2; Tolerance: 1%; Length: 0.039inch; Max Operating Temperature: 155°C; Case/Package: 0402; RoHS Compliant: Yes; Resistor Type: Thick Film
R8 = CMP-03412-049531-1: RES 4.99kΩ ±1% 0.125W 0402; RoHS Compliant: Yes
U1 = CMP-04918-000611-1: IC REG BUCK ADJ 2A TSOT23-6; Max Input Voltage: 5.5V; Min Output Voltage: 600mV; Output Configuration: Positive; Output Type: Adjustable; Synchronous Rectifier: Yes; Switching Frequency: 1.5MHz; Min Input Voltage: 2.5V; Case/Package: SOT-23-6; Max Output Voltage: 5.5V; Mount: Surface Mount; Max Operating Temperature: 125°C; Packaging: Cut Tape; Min Operating Temperature: -40°C; Output Current: 2A; RoHS Compliant: Yes
U2 = CMP-0395-01395-1: Single Output LDO, 1.5 A, Adjustable 0.8 to 3.6 V Output, 0.8 to 5.5 V Input, with Programmable Soft Start, 20-pin VQFN (RGW), -40 to 125 degC, Green (RoHS & no Sb/Br); Manufacturer: Texas Instruments; PartNumber: TPS74801RGWTG4; Accuracy(%): 2; Vin(Min)(V): 0.8; SubFamily: Single Channel LDO; Iout(Max)(A): 1.5; Rating: Catalog; Power Good: TRUE; Vout Adj(Max)(V): 3.6; Vdo(Typ)(mV): 60; Vin(Max)(V): 5.5; Iq(Typ)(mA): 1; PackageReference: RGW20-3150X3150TP; ComponentLink2Description: Datasheet; PackageDescription: 20-Pin Plastic Quad Flat No-Pin, 5 x 5 mm Body, 0.65 mm Pitch, 3.15 x 3.15 mm Exposed Pad; ComponentLink1URL: http://www.ti.com/; DatasheetVersion: SBVS074J; Mounting Technology: Surface Mount; ComponentLink3Description: Package Specification; Vout Adj(Min)(V): 0.8; Code_JEDEC: MO-220; ComponentLink3URL: http://www.ti.com/litv/pdf/mpqf122b; Eco-Plan: Green (RoHS & no Sb/Br); ComponentLink4Description: URL Link1; ComponentLink4URL: Samples URL:http://www.ti.com/product/tps74801#samples; ComponentLink2URL: http://www.ti.com/general/docs/lit/getliterature.tsp?genericPartNumber=TPS74801&fileType=pdf; ComponentLink1Description: Manufacturer URL
U3 = TUSB8044ARGCR: as U3 on sheet Upstream; Mouser Part Number: 595-TUSB8044ARGCR; Mouser Price/Stock: https://www.mouser.co.uk/ProductDetail/Texas-Instruments/TUSB8044ARGCR?qs=9r4v7xj2LnlTBCFutY1Bfg%3D%3D; Manufacturer_Part_Number: TUSB8044ARGCR; Datasheet Link: http://www.ti.com/lit/gpn/TUSB8044A

## Sheet Hub_Core.SchDoc: USB 3.2 Gen 1 4-Port Hub
size 431 x 279 mm; Author: Alberto Marrone; DrawnBy: Alberto Marrone; Engineer: Alberto Marrone; Revision: v1.0; SheetNumber: 4; SheetTotal: 7
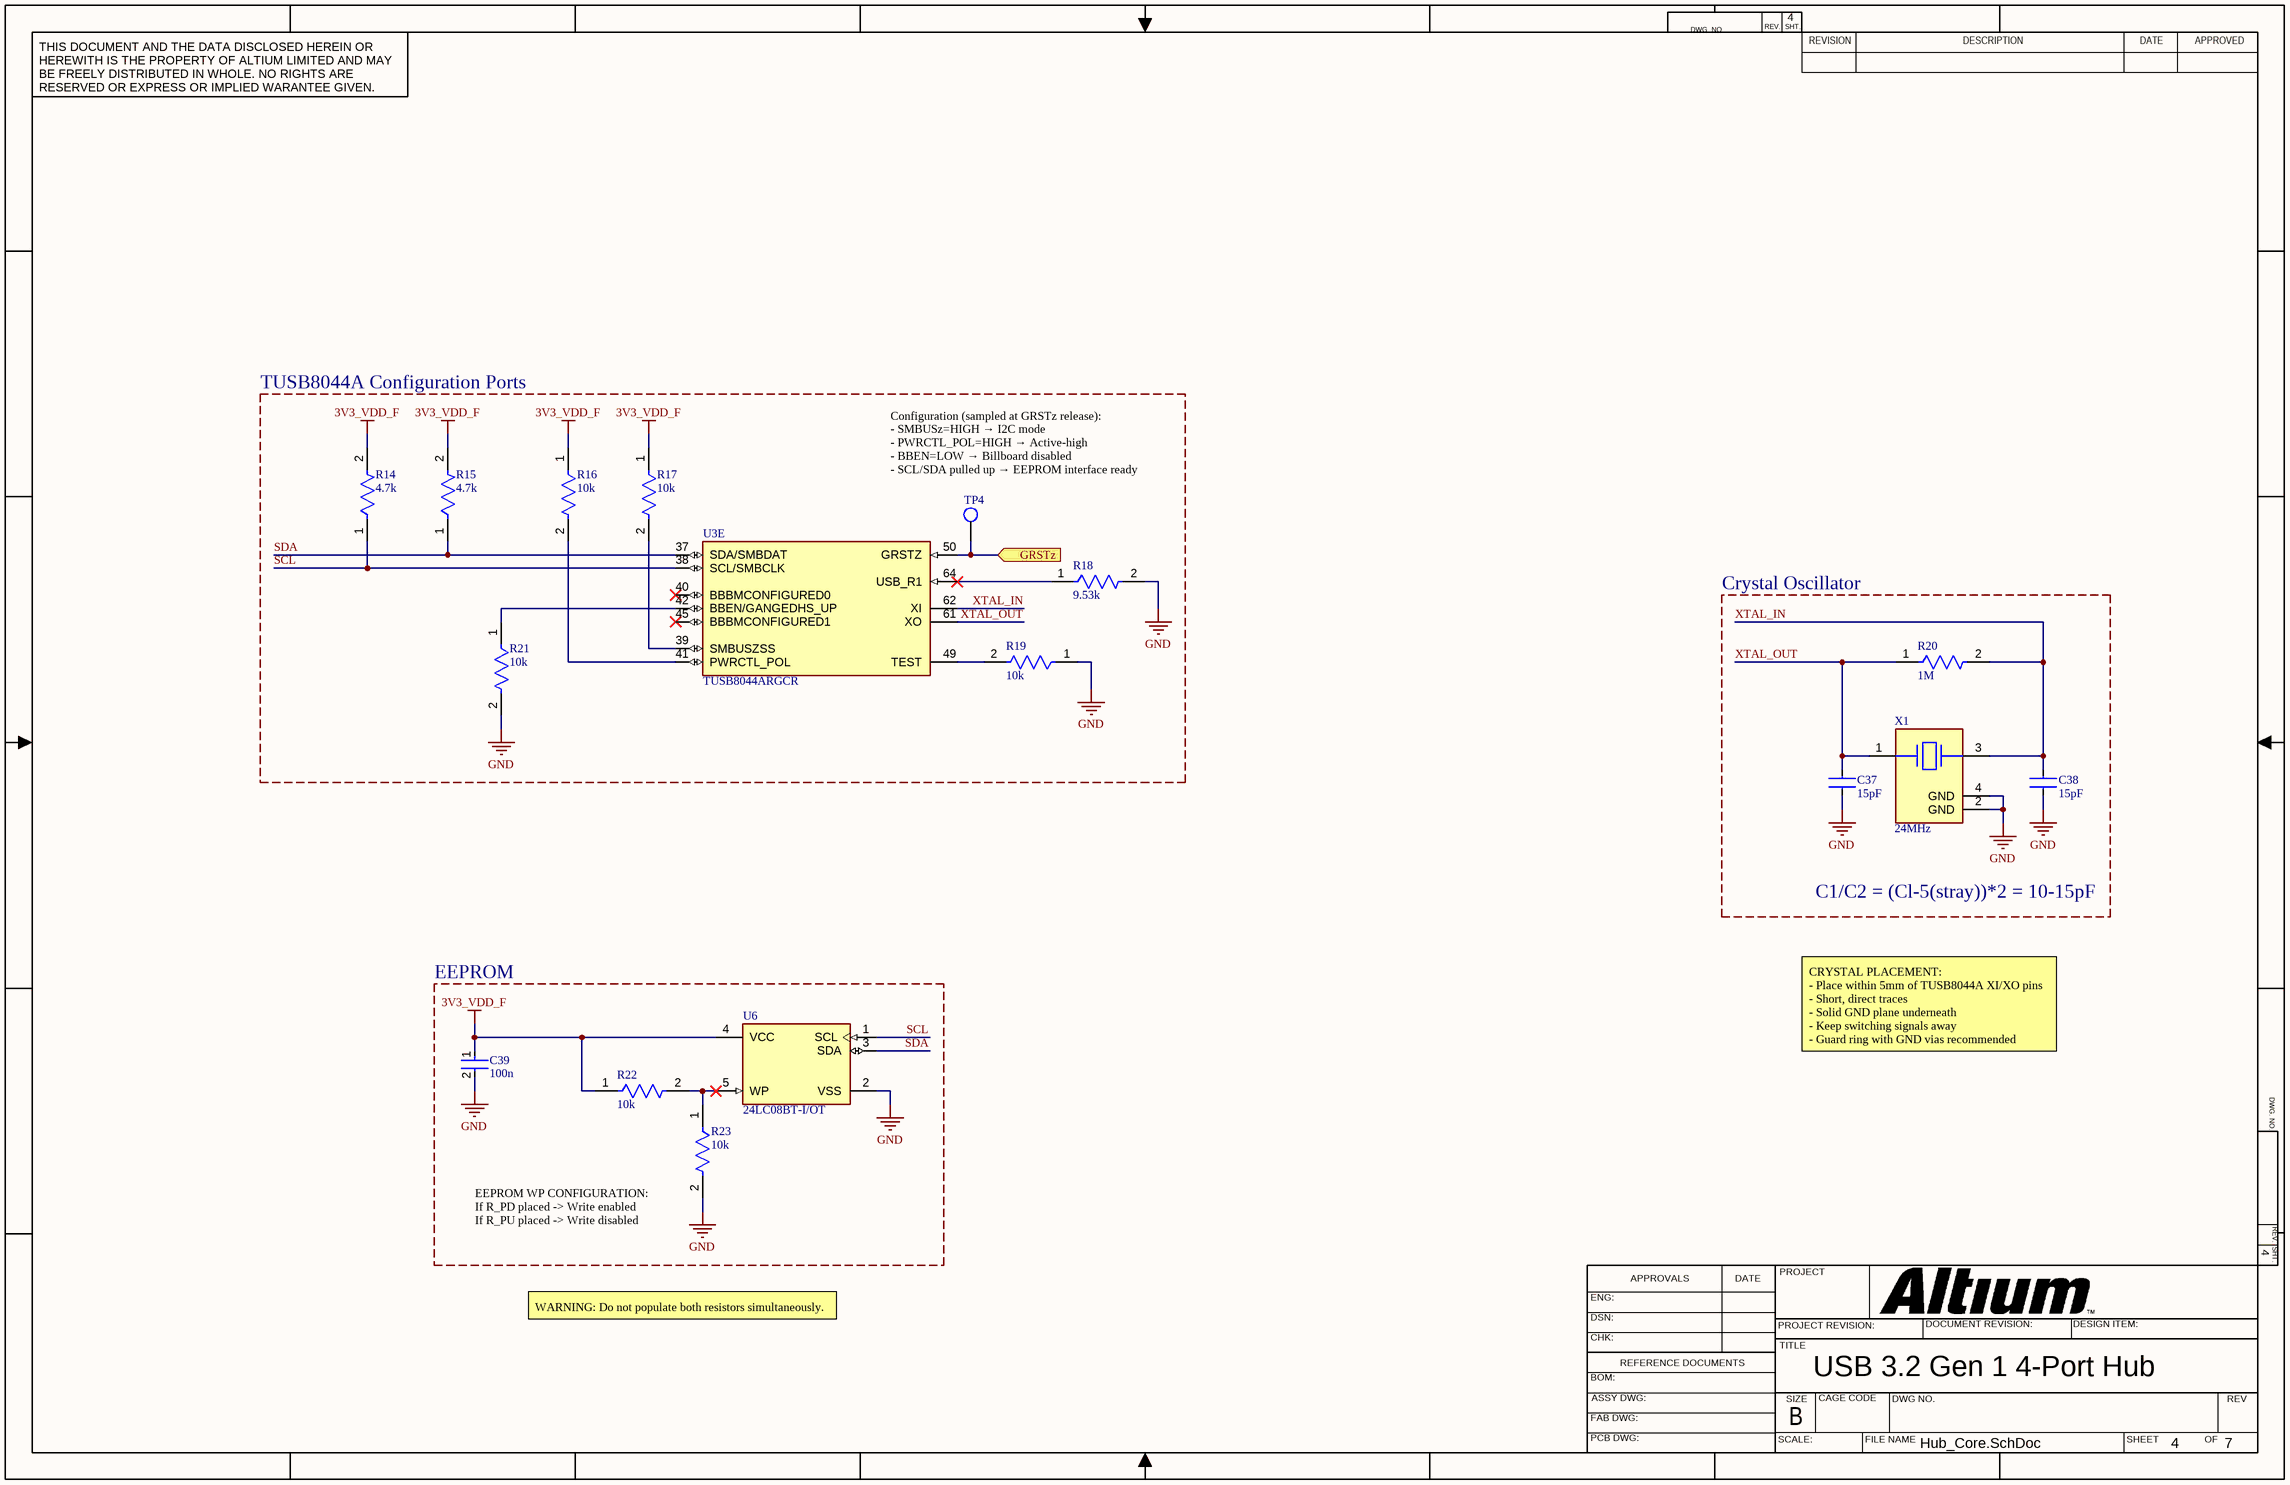
[diagram p3: Hub_Core.SchDoc]

### Parts
C37  15pF  [CAPC1005X56N]
C38  15pF  [CAPC1005X56N]
C39  100n  [FP-GRT155-0_05-IPC_C]
R14  4.7k  [FP-AC0402-MFG]
R15  4.7k  [FP-AC0402-MFG]
R16  10k  [FP-AC0402-MFG]
R17  10k  [FP-AC0402-MFG]
R18  9.53k  [FP-AC0402-IPC_C]
R19  10k  [FP-AC0402-MFG]
R20  1M  [FP-AC0402-IPC_A]
R21  10k  [FP-AC0402-MFG]
R22  10k  [FP-AC0402-MFG]
R23  10k  [FP-AC0402-MFG]
TP4  Test_Point  [Test_Point]  (value not drawn)  (no BOM)
U3  TUSB8044ARGCR  [QFN50P900X900X100-65N-D]  (part E of 6)
U6  24LC08BT-I/OT  [FP-C04-091-OT-MFG]
X1  24MHz  [ABM10N240000MHZ10B1UT3]

### Blocks framed on the sheet
TUSB8044A Configuration Ports: R14-R19 R21 TP4 U3
EEPROM: C39 R22 R23 U6

### Ports
GRSTz (in, see Top_Level[7C], Power[6C])

### Nets
3V3_VDD_F: C39.1 R14.2 R15.2 R16.1 R17.1 R22.1 U6.4(VCC)
GND: C37.1 C38.1 C39.2 R18.2 R19.1 R21.2 R23.2 U6.2(VSS) X1.2(GND) X1.4(GND)
GRSTz: TP4.1 U3.50(GRSTZ) ; port GRSTz
SCL: R14.1 U3.38(SCL/SMBCLK) U6.1(SCL)
SDA: R15.1 U3.37(SDA/SMBDAT) U6.3(SDA)
XTAL_IN: C38.2 R20.2 U3.62(XI) X1.3
XTAL_OUT: C37.2 R20.1 U3.61(XO) X1.1
NetR16_2: R16.2 U3.41(PWRCTL_POL)
NetR17_2: R17.2 U3.39(SMBUSZSS)
NetR18_1: R18.1 U3.64(USB_R1)
NetR19_2: R19.2 U3.49(TEST)
NetR21_1: R21.1 U3.42(BBEN/GANGEDHS_UP)
NetR22_2: R22.2 R23.1 U6.5(WP)

Not connected (* = marked no-connect by the designer): U3 40(BBBMCONFIGURED0)* 45(BBBMCONFIGURED1)*

### Notes on the sheet
- (near TP4) Configuration (sampled at GRSTz release):
  - SMBUSz=HIGH → I2C mode
  - PWRCTL_POL=HIGH → Active-high
  - BBEN=LOW → Billboard disabled
  - SCL/SDA pulled up → EEPROM interface ready
- Crystal Oscillator
- C1/C2 = (Cl-5(stray))*2 = 10-15pF
- CRYSTAL PLACEMENT:
  - Place within 5mm of TUSB8044A XI/XO pins
  - Short, direct traces
  - Solid GND plane underneath
  - Keep switching signals away
  - Guard ring with GND vias recommended
- EEPROM WP CONFIGURATION:
  If R_PD placed -> Write enabled
  If R_PU placed -> Write disabled
- WARNING: Do not populate both resistors simultaneously.
- DWG. NO.
- REV.
- SHT.
- THIS DOCUMENT AND THE DATA DISCLOSED HEREIN OR HEREWITH IS THE PROPERTY OF ALTIUM LIMITED AND MAY BE FREELY DISTRIBUTED IN WHOLE. NO RIGHTS ARE RESERVED OR EXPRESS OR IMPLIED WARANTEE GIVEN.
- REVISION
- DESCRIPTION
- DATE
- APPROVED
- ENG:
- APPROVALS
- PROJECT
- DSN:
- CHK:
- REFERENCE DOCUMENTS
- PROJECT REVISION:
- TITLE
- DOCUMENT REVISION:
- DESIGN ITEM:
- BOM:
- FAB DWG:
- PCB DWG:
- ASSY DWG:
- SCALE:
- SIZE
- B
- CAGE CODE
- FILE NAME
- DWG NO.
- SHEET
- OF
- REV

### Library data of the parts
C37 C38 = 04025U150FAT2A: AVX - 04025U150FAT2A - CAP, MLCC, C0G / NP0, 15PF, 50V, 0402; Manufacturer_Name: Kyocera AVX; Geometry.Height: 0.56mm; Mouser Part Number: 581-04025U150FAT2A; Mouser Price/Stock: https://www.mouser.com/Search/Refine.aspx?Keyword=581-04025U150FAT2A; Manufacturer_Part_Number: 04025U150FAT2A; Datasheet Link: https://componentsearchengine.com/Datasheets/1/04025U150FAT2A.pdf
C39 = CMP-06035-030480-1: as C30 on sheet Upstream
R14 R15 = CMP-03412-009386-2: RES 4.7kΩ ±1% 0.063W 0402
R16 R17 R19 R21-R23 = CMP-2002-01790-3: as R10 on sheet Upstream; Tolerance: 1%; Military Standard: Not; Construction: Rectangular; Termination: SMD/SMT; Max Operating Temperature: 155°C; Min Operating Temperature: -55°C; Height: 0.015inch; Lead Free: Lead Free; Width: 0.02inch; Case/Package: 0402; Resistor Type: Thick Film; Series: AC; Features: Moisture Resistant; RoHS Compliant: Yes; Number of Terminations: 2; Case Code (Metric): 1005; Length: 0.039inch; Depth: 0.5mm; Size Code: 0402; Packaging: Tape and Reel; Case Code (Imperial): 0402
R18 = CMP-03412-035186-2: RES 9.53kΩ ±1% 0.063W 0402; Temperature Coefficient: 100ppm/°C; Max Power Dissipation: 63mW; Resistance: 9.53kR; Number of Terminations: 2; Case/Package: 0402; Width: 0.02inch; Length: 0.039inch; Min Operating Temperature: -55°C; RoHS Compliant: Yes; Max Operating Temperature: 155°C; Series: AC; Resistor Type: Thick Film; Height: 0.015inch; Tolerance: 1%; Features: Moisture Resistant; Packaging: Tape and Reel
R20 = CMP-2002-01800-2: RES 1MΩ ±1% 0.063W 0402; Power Rating: 62.5mW; Max Power Dissipation: 63mW; Temperature Coefficient: 100ppm/°C; Resistance: 1MR; Voltage Rating: 50V; Packaging: Tape and Reel; Lead Free: Lead Free; Depth: 0.5mm; Series: AC; Length: 0.039inch; Resistor Type: Thick Film; Termination: SMD/SMT; Military Standard: Not; Case/Package: 0402; Min Operating Temperature: -55°C; Tolerance: 1%; Features: Moisture Resistant; Size Code: 0402; Case Code (Imperial): 0402; Number of Terminations: 2; Width: 0.5mm; Construction: Rectangular; Height: 0.015inch; RoHS Compliant: Yes; Case Code (Metric): 1005; Max Operating Temperature: 155°C
U3 = TUSB8044ARGCR: as U3 on sheet Upstream; Mouser Part Number: 595-TUSB8044ARGCR; Mouser Price/Stock: https://www.mouser.co.uk/ProductDetail/Texas-Instruments/TUSB8044ARGCR?qs=9r4v7xj2LnlTBCFutY1Bfg%3D%3D; Manufacturer_Part_Number: TUSB8044ARGCR; Datasheet Link: http://www.ti.com/lit/gpn/TUSB8044A
U6 = CMP-0159-00589-2: IC EEPROM 8K I2C 400KHZ SOT23-5; Manufacturer: Microchip; Automotive Grade: Grade 3; Import Ts: 1521846298; Interface: I2C,2-Wire; Memory Size: 8Kbits; Access Time: 900ns; Min Supply Voltage: 2.5V; Nominal Supply Current: 1-3mA; Ciiva Ids: 971476; Max Supply Voltage: 5.5V; ComponentLink2Description: Datasheet; Category: IC; Frequency: 400kHz; Digikey Description: IC EEPROM 8K I2C 400KHZ SOT23-5; Ambient Temperature Range High: +85°C; RoHS: TRUE; Ambient Temperature Range Low: -40°C; Temperature Range High: +85°C; Device Class L3: EEPROM; Device Class L2: Memory; Memory Type: EEPROM; Temperature: -40°C to +85°C; Ipc Land Pattern Name: SOT95P280X118-5; Release Date: 1302228452; Manufacturer Part Number: 24LC08BT-I/OT; Automotive: Yes; Mouser Description: EEPROM 1kx8 - 2.5V; Lead Free: Yes; Height: 1.45mm; Octopart: https://octopart.com/24lc08bt-i%2Fot-microchip-93286; Device Class L1: Integrated Circuits (ICs); Package: C04-091-OT; ComponentLink2URL: http://ww1.microchip.com/downloads/en/DeviceDoc/20001710L.pdf; Temperature Range Low: -40°C
X1 = ABM10N-24.0000MHZ-10-B1U-T3: 24 MHz +/-10ppm Crystal 10pF 50 Ohms 4-SMD, No Lead , -20C ~ 70C; Manufacturer_Name: ABRACON; Geometry.Height: 0.65mm; Mouser Part Number: *; Mouser Price/Stock: *; Manufacturer_Part_Number: ABM10N-24.0000MHZ-10-B1U-T3; Datasheet Link: https://abracon.com/datasheets/ABM10N.pdf

## Sheet Downstream_Port_1.SchDoc: USB 3.2 Gen 1 4-Port Hub
size 431 x 279 mm; Author: Alberto Marrone; DrawnBy: Alberto Marrone; Engineer: Alberto Marrone; Revision: v1.0; SheetNumber: 5; SheetTotal: 7
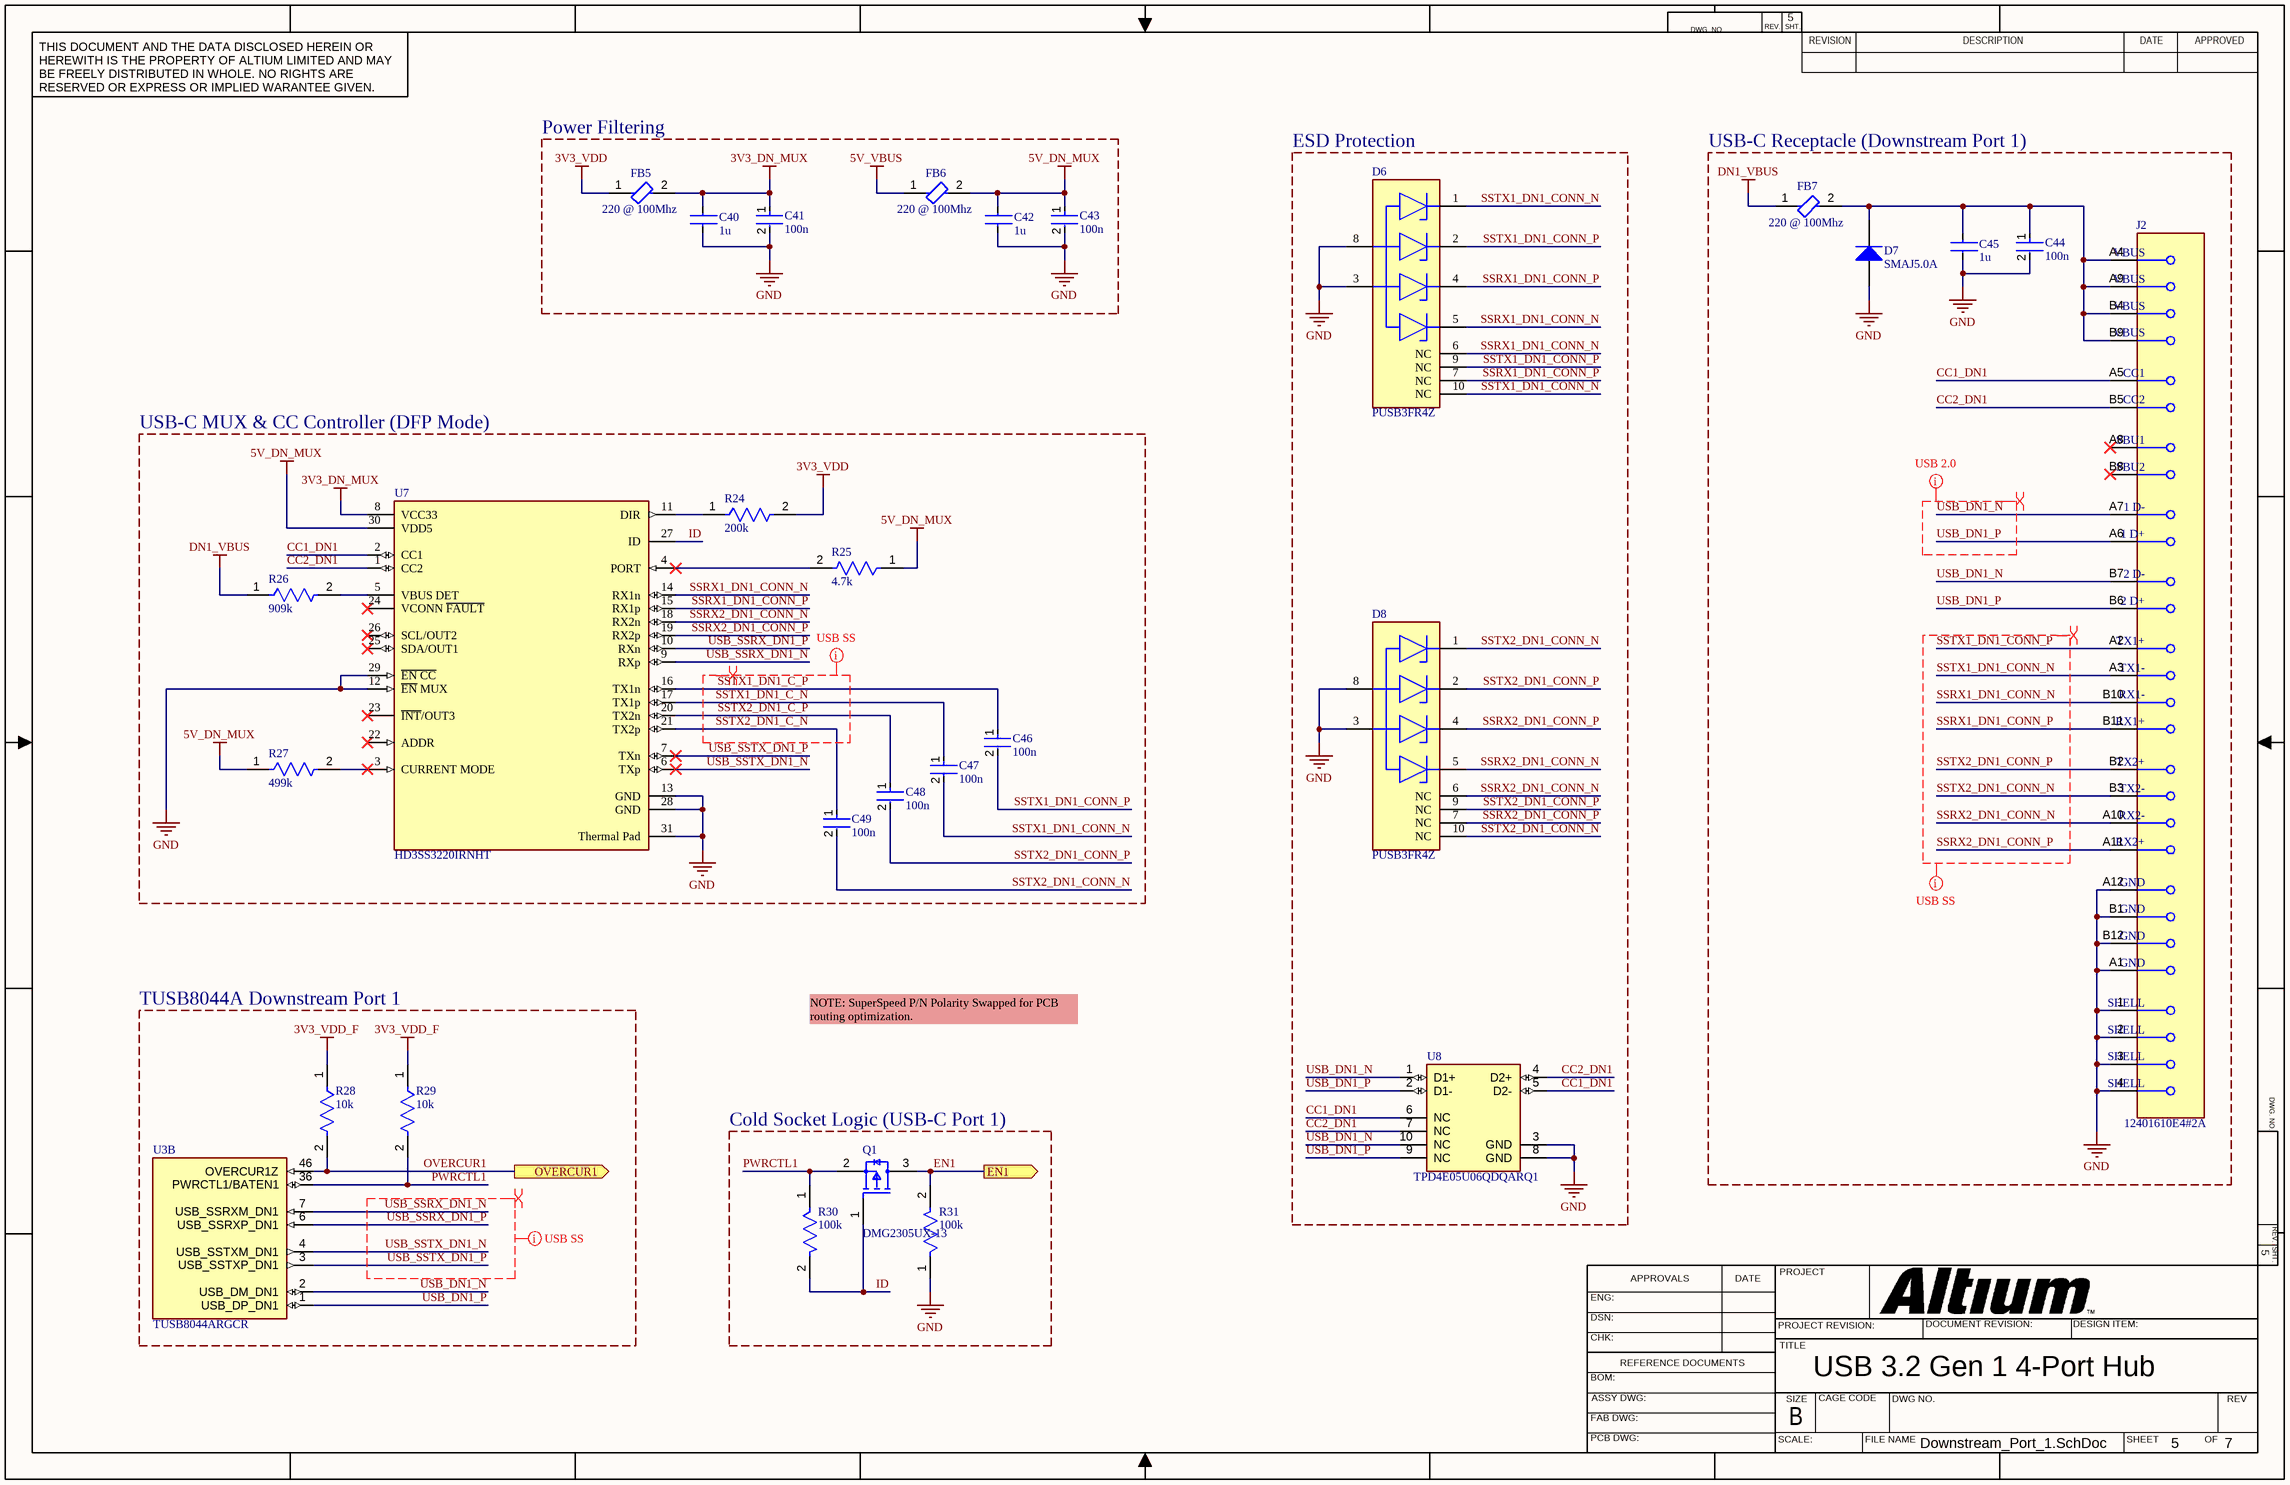
[diagram p4: Downstream_Port_1.SchDoc]

### Parts
C40  1u  [CAPC1608X90N]
C41  100n  [FP-GRT155-0_05-IPC_C]
C42  1u  [CAPC1608X90N]
C43  100n  [FP-GRT155-0_05-IPC_C]
C44  100n  [FP-GRT155-0_05-IPC_C]
C45  1u  [CAPC1608X90N]
C46  100n  [FP-GRT155-0_05-IPC_C]
C47  100n  [FP-GRT155-0_05-IPC_C]
C48  100n  [FP-GRT155-0_05-IPC_C]
C49  100n  [FP-GRT155-0_05-IPC_C]
D6  PUSB3FR4Z  [FP-SOT1176-1-MFG]
D7  SMAJ5.0A  [BOUR-SMA-2_V]
D8  PUSB3FR4Z  [FP-SOT1176-1-MFG]
FB5  220 @ 100Mhz  [FP-BLM21-0_2-t0_85-e0_5-IPC_B]
FB6  220 @ 100Mhz  [FP-BLM21-0_2-t0_85-e0_5-IPC_B]
FB7  220 @ 100Mhz  [FP-BLM21-0_2-t0_85-e0_5-IPC_B]
J2  12401610E4#2A  [FP-12401610E4#2A-MFG]
Q1  DMG2305UX-13  [FP-SOT23-MFG]
R24  200k  [FP-AC0402-MFG]
R25  4.7k  [FP-AC0402-MFG]
R26  909k  [FP-AC0402-IPC_A]
R27  499k  [FP-AC0402-IPC_C]
R28  10k  [FP-AC0402-MFG]
R29  10k  [FP-AC0402-MFG]
R30  100k  [FP-AC0402-MFG]
R31  100k  [FP-AC0402-MFG]
U3  TUSB8044ARGCR  [QFN50P900X900X100-65N-D]  (part B of 6)
U7  HD3SS3220IRNHT  [FP-RNH0030A-MFG]
U8  TPD4E05U06QDQARQ1  [FP-DQA0010A-MFG]

### Blocks framed on the sheet
Power Filtering: C40-C43 FB5 FB6
ESD Protection: D6 D8 U8
USB-C Receptacle (Downstream Port 1): C44 C45 D7 FB7 J2
USB-C MUX & CC Controller (DFP Mode): C46-C49 R24-R27 U7
TUSB8044A Downstream Port 1: R28 R29 U3
Cold Socket Logic (USB-C Port 1): Q1 R30 R31

### Ports
EN1 (out, see Top_Level[4D], Downstream_Port_2[6B]), OVERCUR1 (out, see Top_Level[3D], Downstream_Port_2[6B])

### Nets
3V3_DN_MUX: C40.2 C41.1 FB5.2 U7.8(VCC33)
3V3_VDD: FB5.1 R24.2
3V3_VDD_F: R28.1 R29.1
5V_DN_MUX: C42.2 C43.1 FB6.2 R25.1 R27.1 U7.30(VDD5)
5V_VBUS: FB6.1
DN1_VBUS: FB7.1 R26.1
GND: C40.1 C41.2 C42.1 C43.2 C44.2 C45.1 D6.3(GND) D6.8(GND) D7.1(A) D8.3(GND) D8.8(GND) J2.1(SHELL) J2.2(SHELL) J2.3(SHELL) J2.4(SHELL) J2.A1(GND) J2.A12(GND) J2.B1(GND) J2.B12(GND) R31.1 U7.12(~{EN}_MUX) U7.13(GND) U7.28(GND) U7.29(~{EN_CC}) U7.31(Thermal_Pad) U8.3(GND) U8.8(GND)
CC1_DN1: J2.A5(CC1) U7.2(CC1) U8.5(D2-) U8.6(NC)
CC2_DN1: J2.B5(CC2) U7.1(CC2) U8.4(D2+) U8.7(NC)
EN1: Q1.3(D) R31.2 ; port EN1
ID: Q1.1(G) R30.2 U7.27(ID)
OVERCUR1: R28.2 U3.46(OVERCUR1Z) ; port OVERCUR1
PWRCTL1: Q1.2(S) R29.2 R30.1 U3.36(PWRCTL1/BATEN1)
SSRX1_DN1_CONN_N: D6.5(CH4) D6.6(NC) J2.B10(RX1-) U7.14(RX1n)
SSRX1_DN1_CONN_P: D6.4(CH3) D6.7(NC) J2.B11(RX1+) U7.15(RX1p)
SSRX2_DN1_CONN_N: D8.5(CH4) D8.6(NC) J2.A10(RX2-) U7.18(RX2n)
SSRX2_DN1_CONN_P: D8.4(CH3) D8.7(NC) J2.A11(RX2+) U7.19(RX2p)
SSTX1_DN1_C_N: C47.1 U7.17(TX1p)
SSTX1_DN1_C_P: C46.1 U7.16(TX1n)
SSTX1_DN1_CONN_N: C47.2 D6.1(CH1) D6.10(NC) J2.A3(TX1-)
SSTX1_DN1_CONN_P: C46.2 D6.2(CH2) D6.9(NC) J2.A2(TX1+)
SSTX2_DN1_C_N: C49.1 U7.21(TX2p)
SSTX2_DN1_C_P: C48.1 U7.20(TX2n)
SSTX2_DN1_CONN_N: C49.2 D8.1(CH1) D8.10(NC) J2.B3(TX2-)
SSTX2_DN1_CONN_P: C48.2 D8.2(CH2) D8.9(NC) J2.B2(TX2+)
USB_DN1_N: J2.A7(1_D-) J2.B7(2_D-) U3.2(USB_DM_DN1) U8.1(D1+) U8.10(NC)
USB_DN1_P: J2.A6(1_D+) J2.B6(2_D+) U3.1(USB_DP_DN1) U8.2(D1-) U8.9(NC)
USB_SSRX_DN1_N: U3.7(USB_SSRXM_DN1) U7.9(RXp)
USB_SSRX_DN1_P: U3.6(USB_SSRXP_DN1) U7.10(RXn)
USB_SSTX_DN1_N: U3.4(USB_SSTXM_DN1) U7.6(TXp)
USB_SSTX_DN1_P: U3.3(USB_SSTXP_DN1) U7.7(TXn)
NetC44_1: C44.1 C45.2 D7.2(K) FB7.2 J2.A4(VBUS) J2.A9(VBUS) J2.B4(VBUS) J2.B9(VBUS)
NetR24_1: R24.1 U7.11(DIR)
NetR25_2: R25.2 U7.4(PORT)
NetR26_2: R26.2 U7.5(VBUS_DET)
NetR27_2: R27.2 U7.3(CURRENT_MODE)

Not connected (* = marked no-connect by the designer): J2 A8(SBU1)* B8(SBU2)*; U7 22(ADDR)* 23(~{INT}/OUT3)* 24(VCONN_~{FAULT})* 25(SDA/OUT1)* 26(SCL/OUT2)*

### Layout directives
differential pair: SSRX1_DN1_CONN_N, SSRX1_DN1_CONN_P, SSRX2_DN1_CONN_N, SSRX2_DN1_CONN_P, SSTX1_DN1_C_N, SSTX1_DN1_C_P, SSTX1_DN1_CONN_N, SSTX1_DN1_CONN_P, SSTX2_DN1_C_N, SSTX2_DN1_C_P, SSTX2_DN1_CONN_N, SSTX2_DN1_CONN_P, USB_DN1_N, USB_DN1_P, USB_SSRX_DN1_N, USB_SSRX_DN1_P, USB_SSTX_DN1_N, USB_SSTX_DN1_P
net class USB_HighSpeed: USB_DN1_N, USB_DN1_P
net class USB_SuperSpeed: SSRX1_DN1_CONN_N, SSRX1_DN1_CONN_P, SSRX2_DN1_CONN_N, SSRX2_DN1_CONN_P, SSTX1_DN1_C_N, SSTX1_DN1_C_P, SSTX1_DN1_CONN_N, SSTX1_DN1_CONN_P, SSTX2_DN1_C_N, SSTX2_DN1_C_P, SSTX2_DN1_CONN_N, SSTX2_DN1_CONN_P, USB_SSRX_DN1_N, USB_SSRX_DN1_P, USB_SSTX_DN1_N, USB_SSTX_DN1_P

### Notes on the sheet
- NOTE: SuperSpeed P/N Polarity Swapped for PCB routing optimization.
- DWG. NO.
- REV.
- SHT.
- THIS DOCUMENT AND THE DATA DISCLOSED HEREIN OR HEREWITH IS THE PROPERTY OF ALTIUM LIMITED AND MAY BE FREELY DISTRIBUTED IN WHOLE. NO RIGHTS ARE RESERVED OR EXPRESS OR IMPLIED WARANTEE GIVEN.
- REVISION
- DESCRIPTION
- DATE
- APPROVED
- ENG:
- APPROVALS
- PROJECT
- DSN:
- CHK:
- REFERENCE DOCUMENTS
- PROJECT REVISION:
- TITLE
- DOCUMENT REVISION:
- DESIGN ITEM:
- BOM:
- FAB DWG:
- PCB DWG:
- ASSY DWG:
- SCALE:
- SIZE
- B
- CAGE CODE
- FILE NAME
- DWG NO.
- SHEET
- OF
- REV

### Library data of the parts
C40 C42 C45 = C1608X7R1H105K080AB: as C28 on sheet Upstream; Mouser Part Number: 810-C1608X7R1H105K08; Mouser Price/Stock: https://www.mouser.co.uk/ProductDetail/TDK/C1608X7R1H105K080AB?qs=efUn273yAhdzCWVW9RXgig%3D%3D; Manufacturer_Part_Number: C1608X7R1H105K080AB; Datasheet Link: https://media.digikey.com/pdf/Data%20Sheets/TDK%20PDFs/mlcc_commercial_general_Rev2018.pdf
C41 C43 C44 C46-C49 = CMP-06035-030480-1: as C30 on sheet Upstream
D6 D8 = CMP-14432-000005-1: TVS DIODE 3.3VWM 3VC DFN2510A-10; RoHS Compliant: Yes
D7 = CMP-2000-07090-1: as D3 on sheet Upstream; Supplier Device Package: SMA(DO-214AC); Operating Temperature: -55°C~150°C(TJ); Package Description: 2-Pin Surface Mount Device, Body 4.315 x 2.605 mm; Datasheet URL: https://datasheet.ciiva.com/25624/0900766b8112213b-25624680.pdf; Manufacturer URL: http://www.bourns.com/; Datasheet Version: 08/2012; Series: SMAJ; Family: TVS-Diodes; Bidirectional Channels: -; Applications: GeneralPurpose; Package Reference: SMA-2; Standard Package: 1; Package / Case: DO-214AC,SMA; Category: CircuitProtection; RoHS Information: SMAJSeriesMaterialDeclaration; Mounting Technology: SurfaceMount; Capacitance @ Frequency: -; Packaging: Digi-Reel®; Mounting Type: SurfaceMount
FB5-FB7 = CMP-0686-00610-3: as FB3 on sheet Upstream; Radiation Hardening: No; Material: Ferrite; Frequency: 100MHz; Width: 1.25mm; DC Current: 2A; Max DC Current: 2A; Number of Lines: 1; Package Quantity: 1; Case Code (Metric): 2012; Current Rating: 2A; Case/Package: 0805; Current: 2A; Military Standard: Not; Core Material: Ferrite; Depth: 1.25mm; Contact Plating: Tin; DC Resistance-Max: 45mR; Max Operating Temperature: 125°C; Length: 2mm; Max Current Rating: 2A; REACH SVHC: No SVHC; Termination: SMD/SMT; Min Operating Temperature: -55°C; Series: BLM21P; Test Frequency: 100MHz; Tolerance: 25%; Number of Pins: 2; RoHS Compliant: Yes; Height: 0.85mm; Packaging: Tape and Reel; Lead Free: Lead Free; Case Code (Imperial): 0805
J2 = CMP-02355-000003-1: as J1 on sheet Upstream; Packaging: Cut Tape; Mount: Surface Mount; Number of Pins: 24
Q1 = CMP-12801-000021-1: MOSFET P-CH 20V 4.2A SOT23; Manufacturer: Diodes Inc.; Input Capacitace At Vds: 808pF @ -15V; Rthja Max: 90°C/W; Drain To Source Voltage: -20V; Standoff Height: 0.013mm; Number Of P Channels: 1; Gate To Source Voltage: 8V; Turn On Delay Time: 10.8ns; Pulse Drain Current: -15A; Threshold Vgs Max: -0.9V; Max Junction Temp: +150°C; Depletion Mode: False; Drain To Source Resistance: 40mΩ; Threshold Vgs Min: -0.5V; Continuous Drain Current: -4.2A; Turn Off Delay Time: 79.3ns; Gate Charge At Vgs: 10.2nC @ -4.5V; Power Dissipation: 1.4W; Digikey Description: MOSFET P-CH 20V 4.2A SOT23; Temperature Range High: +150°C; Height: 1.1mm; Package: SOT23; Footprint Url: https://www.diodes.com/assets/Package-Files/SOT23.pdf; Device Class L3: MOSFETs; RoHS: TRUE; Temperature: -55°C to +150°C; Mouser Description: MOSFET P-Ch ENH FET -20V 52mOhm -5.0V; Temperature Range Low: -55°C; ComponentLink2Description: Datasheet; Manufacturer Part Number: DMG2305UX-13; Octopart: https://octopart.com/dmg2305ux-13-diodes+inc.-29925594; Ipc Land Pattern Name: SOT92P240X102-3; Device Class L2: Transistors; Automotive: No; Number Of Channels: 1; Drain To Source Breakdown Voltage: -20V; Lead Free: Yes; Device Class L1: Discrete Semiconductors; Category: Trans; ComponentLink2URL: https://www.diodes.com/assets/Datasheets/DMG2305UX.pdf
R24 = CMP-03412-002362-2: as R11 on sheet Upstream; RoHS Compliant: Yes; Series: AC; Height: 0.015inch; Termination: SMD/SMT; Case Code (Imperial): 0402; Min Operating Temperature: -55°C; Weight: 2.3E-05oz; Case Code (Metric): 1005; Case/Package: 0402; Max Operating Temperature: 155°C; Width: 0.5mm; Size Code: 0402; Features: Moisture Resistant; Number of Terminations: 2; Tolerance: 1%; Packaging: Tape and Reel; Lead Free: Lead Free; Resistor Type: Thick Film; Length: 0.039inch
R25 = CMP-03412-009386-2: RES 4.7kΩ ±1% 0.063W 0402
R26 = CMP-03412-019105-2: as R13 on sheet Upstream; Number of Terminations: 2; Packaging: Tape and Reel; Height: 0.015inch; Max Operating Temperature: 155°C; Series: AC; Resistor Type: Thick Film; Features: Moisture Resistant; Width: 0.5mm; RoHS Compliant: Yes; Length: 0.039inch; Case/Package: 0402; Min Operating Temperature: -55°C; Tolerance: 1%; Termination: SMD/SMT; Case Code (Imperial): 0402; Case Code (Metric): 1005
R27 = CMP-03412-006289-2: RES 499kΩ ±1% 0.063W 0402; Resistance: 499kR; Max Power Dissipation: 63mW; Temperature Coefficient: 100ppm/°C; Case/Package: 0402; Tolerance: 1%; Series: AC; Number of Terminations: 2; Features: Moisture Resistant; Case Code (Imperial): 0402; Packaging: Tape and Reel; Resistor Type: Thick Film; Min Operating Temperature: -55°C; RoHS Compliant: Yes; Ratings: AEC-Q200; Width: 0.02inch; Length: 0.039inch; Height: 0.015inch; Max Operating Temperature: 155°C; Case Code (Metric): 1005
R28 R29 = CMP-2002-01790-3: as R10 on sheet Upstream; Tolerance: 1%; Military Standard: Not; Construction: Rectangular; Termination: SMD/SMT; Max Operating Temperature: 155°C; Min Operating Temperature: -55°C; Height: 0.015inch; Lead Free: Lead Free; Width: 0.02inch; Case/Package: 0402; Resistor Type: Thick Film; Series: AC; Features: Moisture Resistant; RoHS Compliant: Yes; Number of Terminations: 2; Case Code (Metric): 1005; Length: 0.039inch; Depth: 0.5mm; Size Code: 0402; Packaging: Tape and Reel; Case Code (Imperial): 0402
R30 R31 = CMP-03412-039042-1: RES 100kΩ ±1% 0.125W 0402
U3 = TUSB8044ARGCR: as U3 on sheet Upstream; Mouser Part Number: 595-TUSB8044ARGCR; Mouser Price/Stock: https://www.mouser.co.uk/ProductDetail/Texas-Instruments/TUSB8044ARGCR?qs=9r4v7xj2LnlTBCFutY1Bfg%3D%3D; Manufacturer_Part_Number: TUSB8044ARGCR; Datasheet Link: http://www.ti.com/lit/gpn/TUSB8044A
U7 = CMP-04877-000019-1: as U5 on sheet Upstream; Mount: Surface Mount; Max Operating Temperature: 70°C; Lead Free: Lead Free; RoHS Compliant: Yes; Packaging: Tape and Reel; Number of Pins: 30; Min Operating Temperature: 0°C; REACH SVHC: No SVHC
U8 = CMP-04985-000004-1: as U4 on sheet Upstream; Operating Supply Voltage: 5.5V; Reverse Standoff Voltage: 5.5V; Package: DQA0010A; Temperature Range Low: -40°C; Temperature Range High: +125°C; Ambient Temperature Range Low: -40°C; Device Class L1: Circuit Protection; Clamping Voltage: 14V; Manufacturer Part Number: TPD4E05U06QDQARQ1; Device Class L2: ESD and Circuit Protection ICs; Octopart: https://octopart.com/tpd4e05u06qdqarq1-texas+instruments-48523459; Device Class L3: unset; Height: 0.55mm; Automotive: Yes; ComponentLink2Description: Datasheet; RoHS: TRUE; Ambient Temperature Range High: +125°C; Category: IC; Mouser Description: Automotive 4-Channel ESD Protection Solution for SuperSpeed (up to 5 Gbps) Interface 10-USON -40 to 125; Temperature: -40°C to +125°C; ComponentLink2URL: http://www.ti.com/lit/ds/symlink/tpd4e05u06-q1.pdf; Digikey Description: TVS DIODE 5.5V 14V 10USON; Lead Free: Yes